# Altium schematic sheet Sheet1.SchDoc: RBCM_Mother
size A1; SheetNumber: 1; SheetTotal: 3
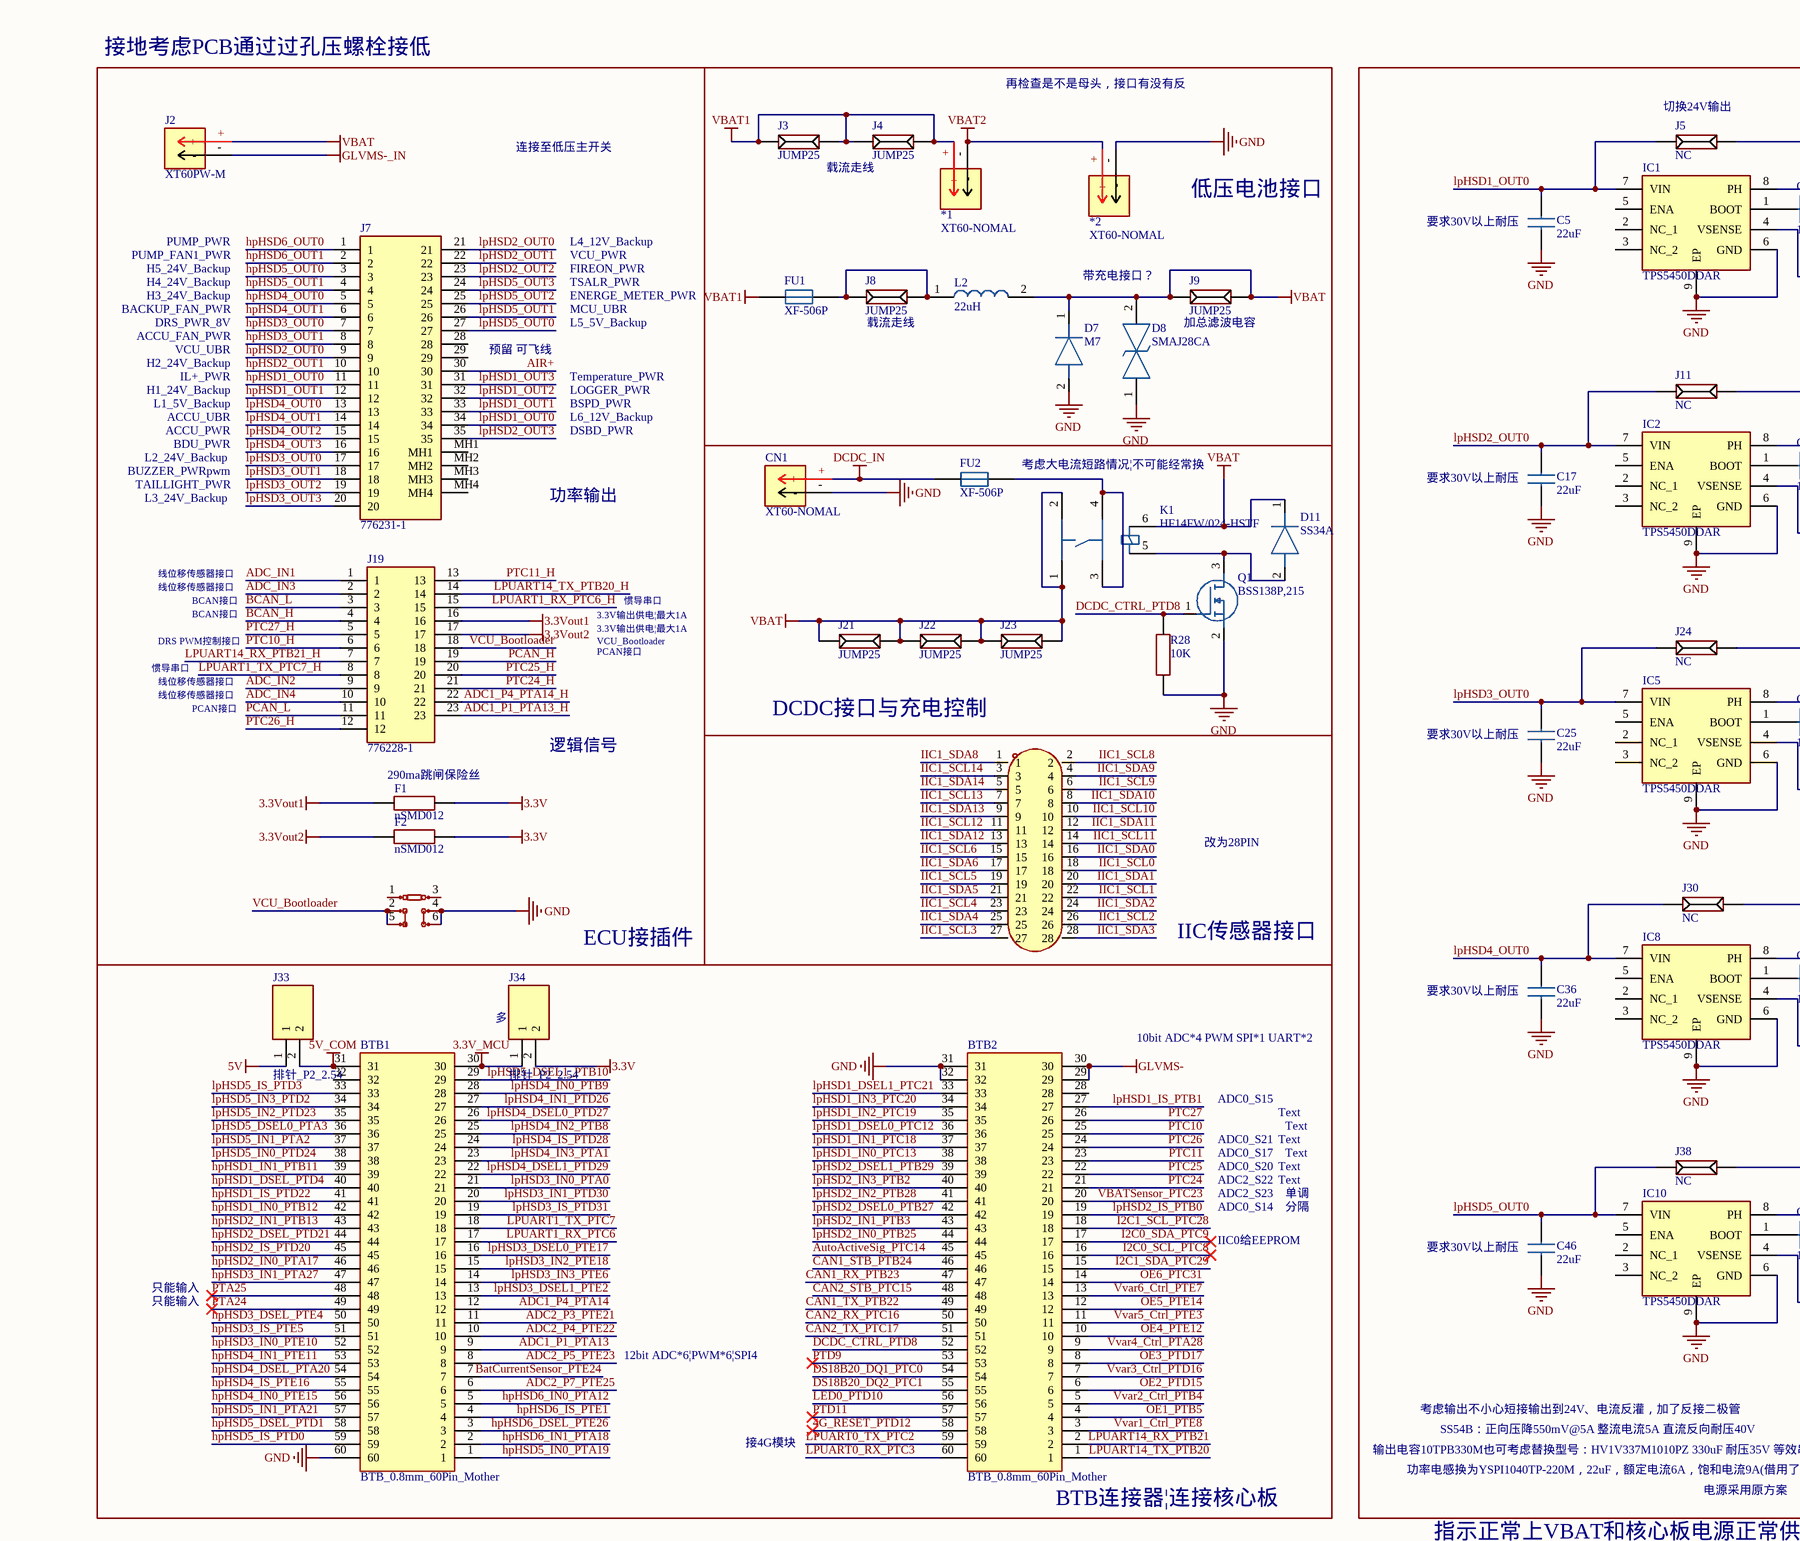
[diagram p0: Sheet1.SchDoc, top left]
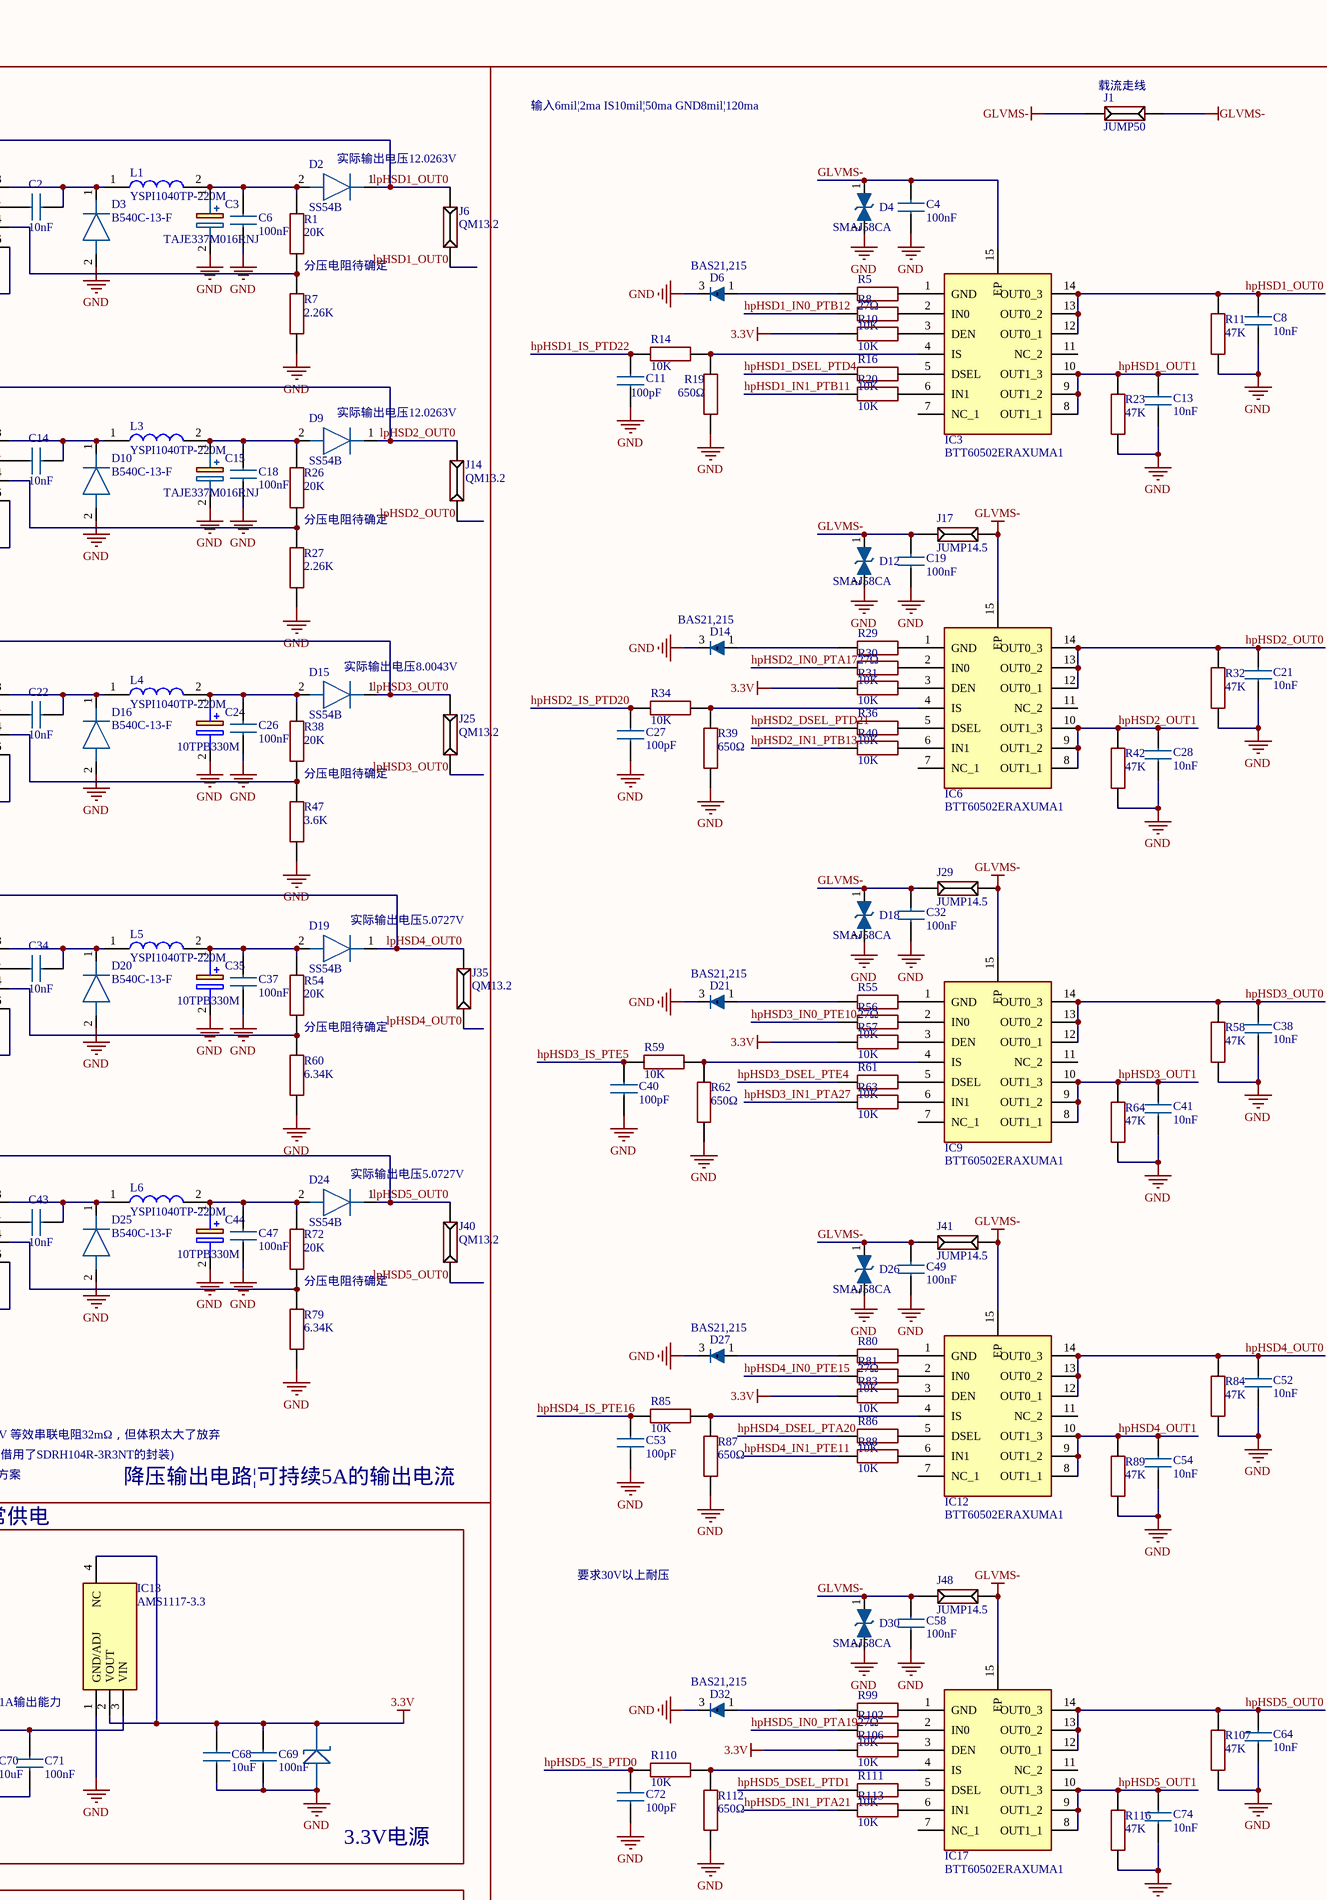
[diagram p1: Sheet1.SchDoc, top middle]
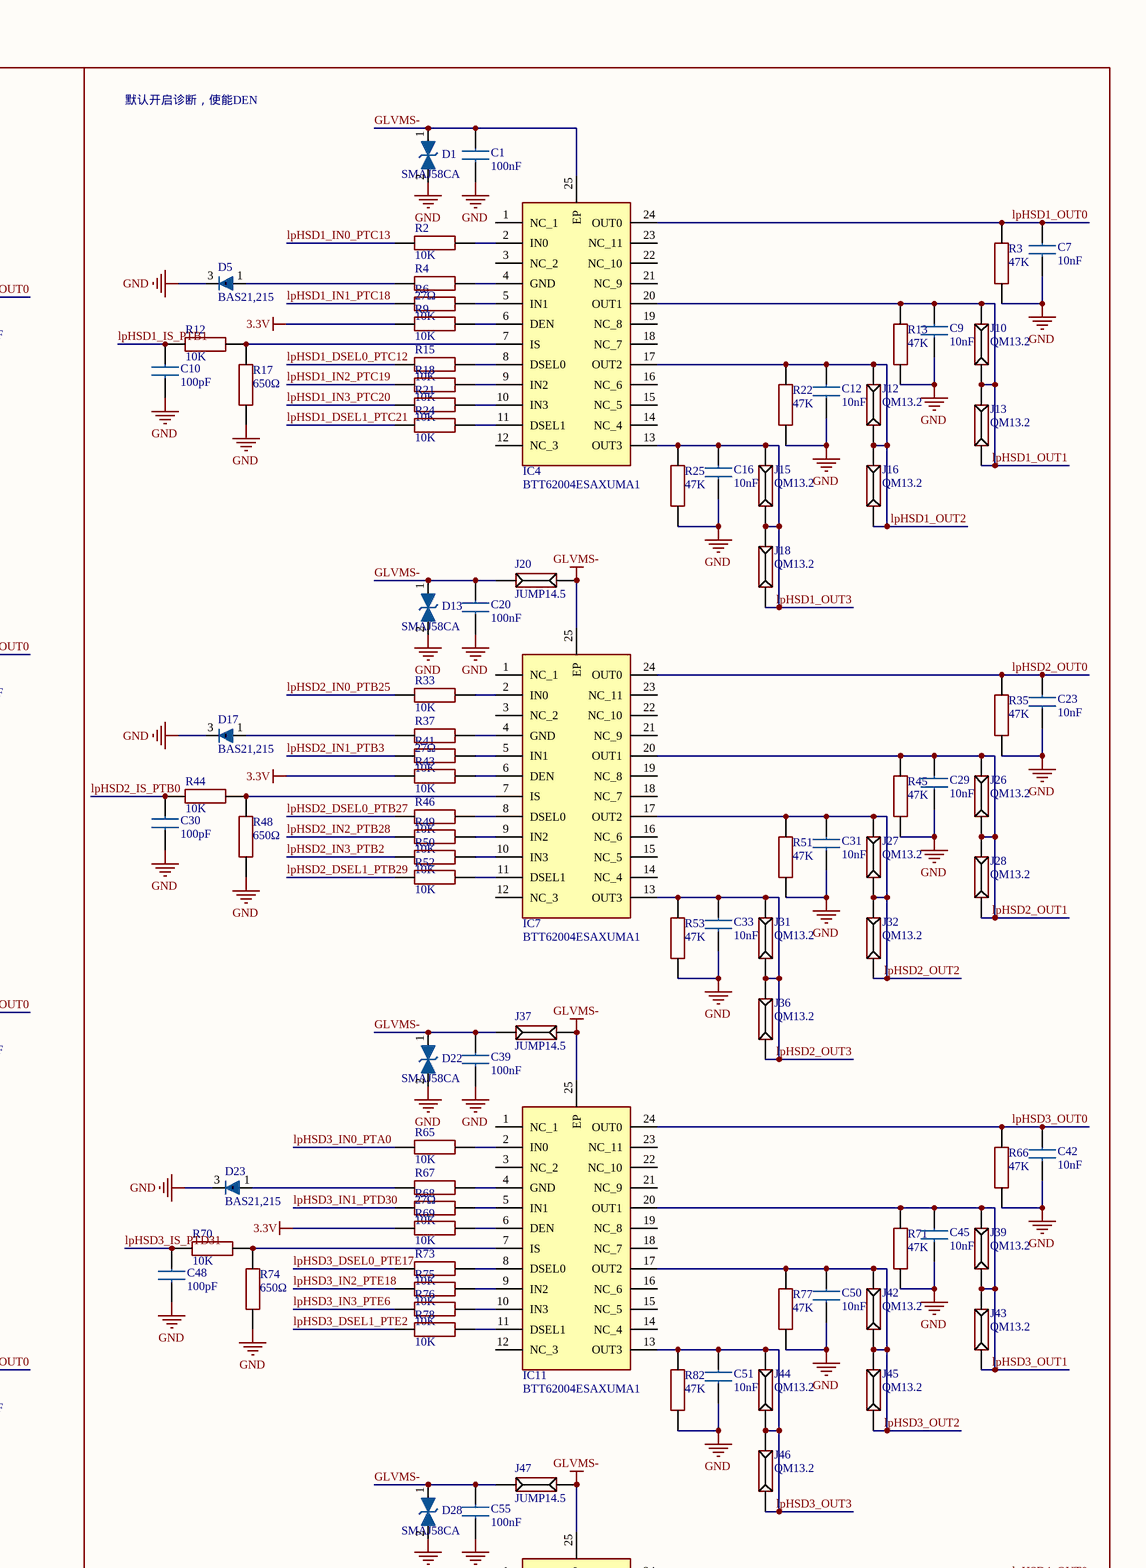
[diagram p2: Sheet1.SchDoc, top right]
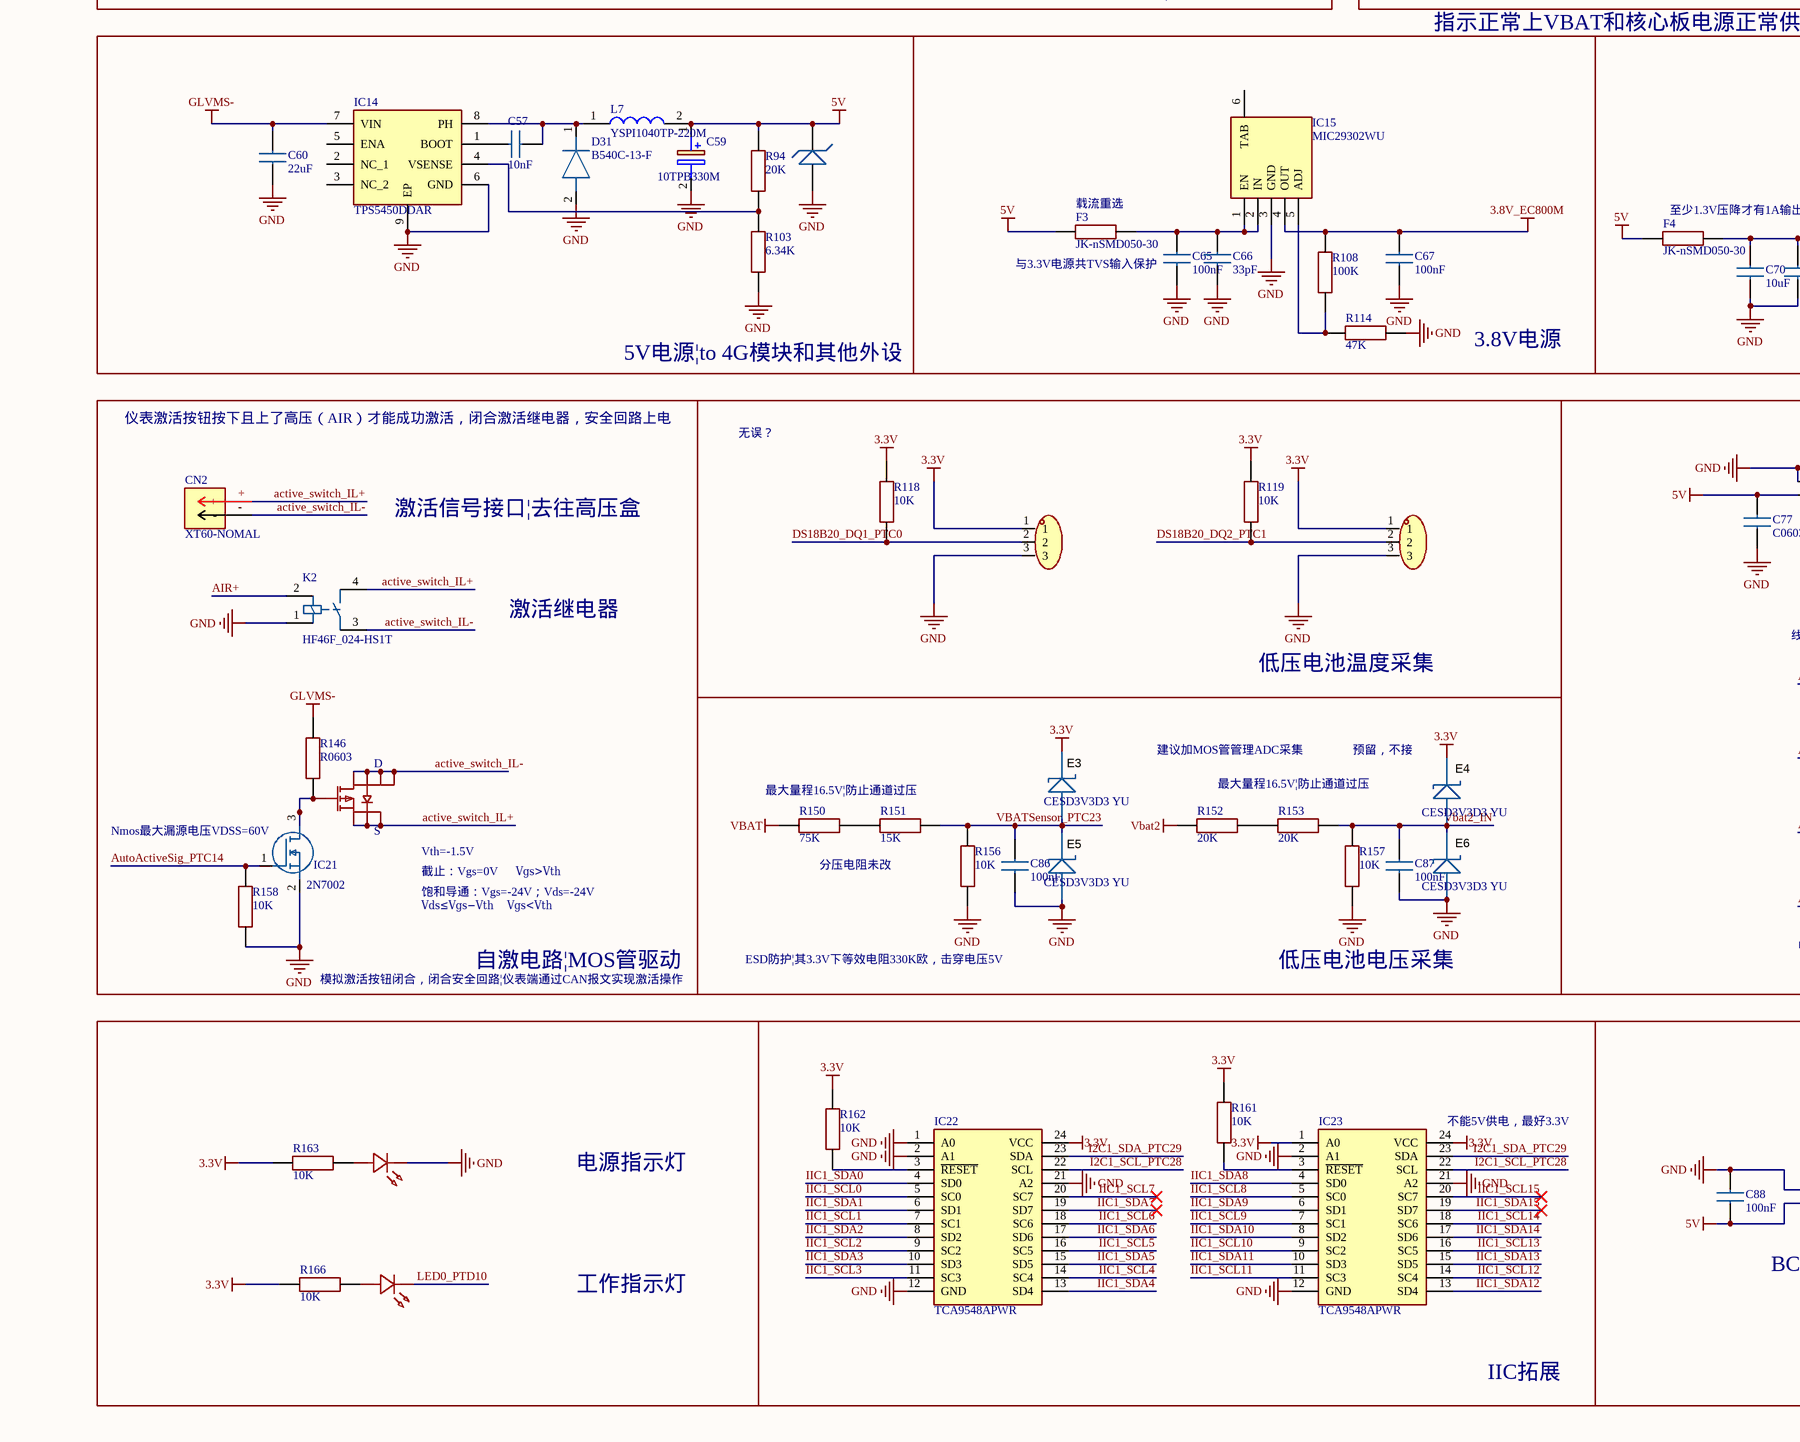
[diagram p3: Sheet1.SchDoc, bottom left]
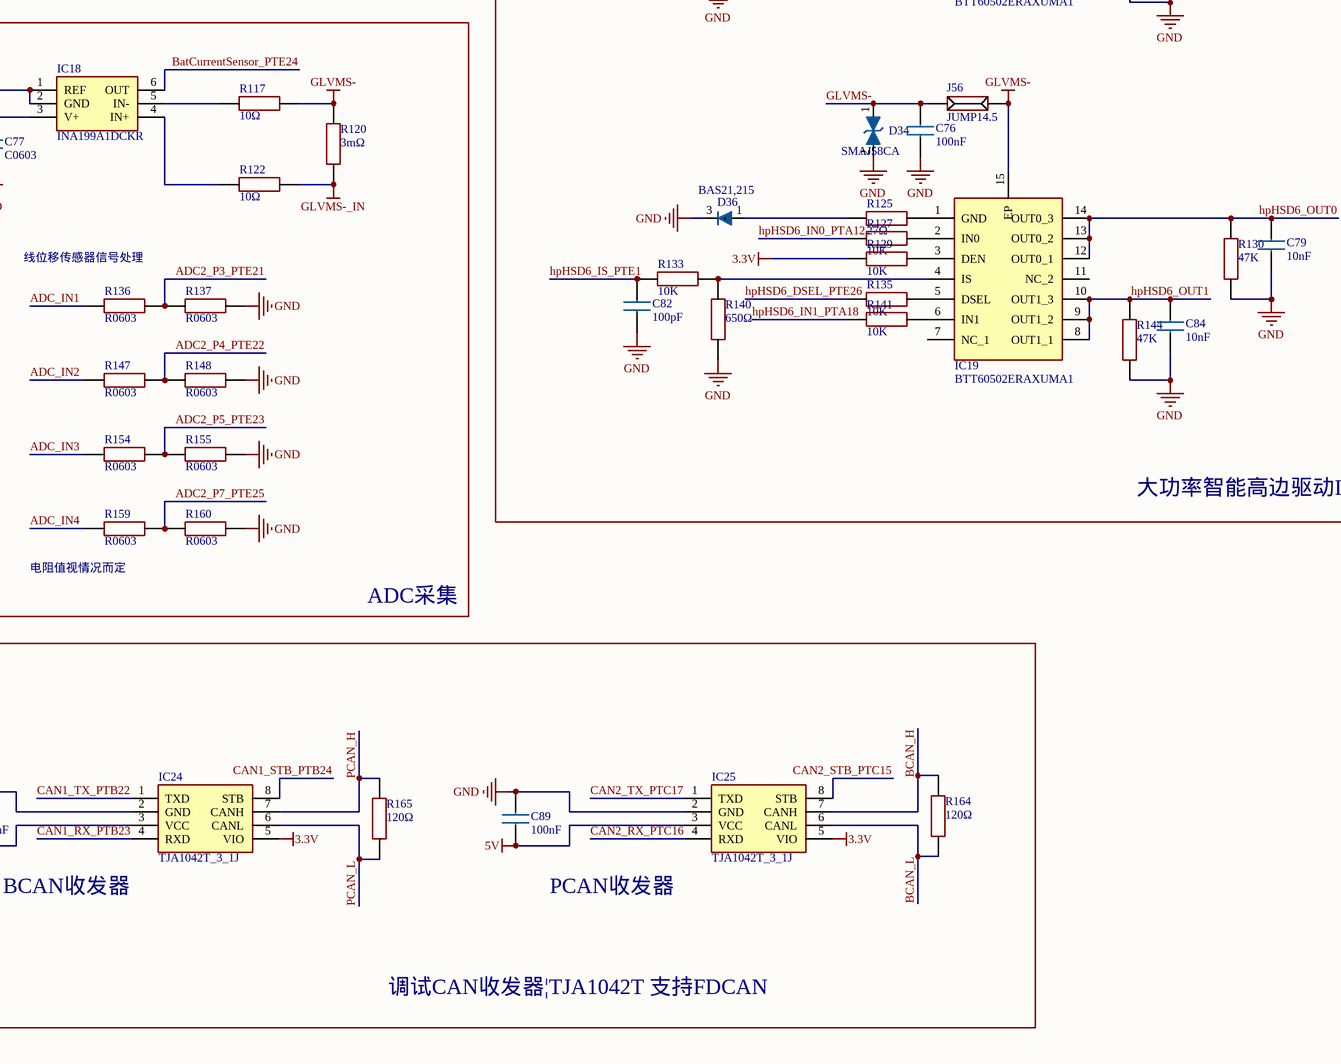
[diagram p4: Sheet1.SchDoc, bottom middle]
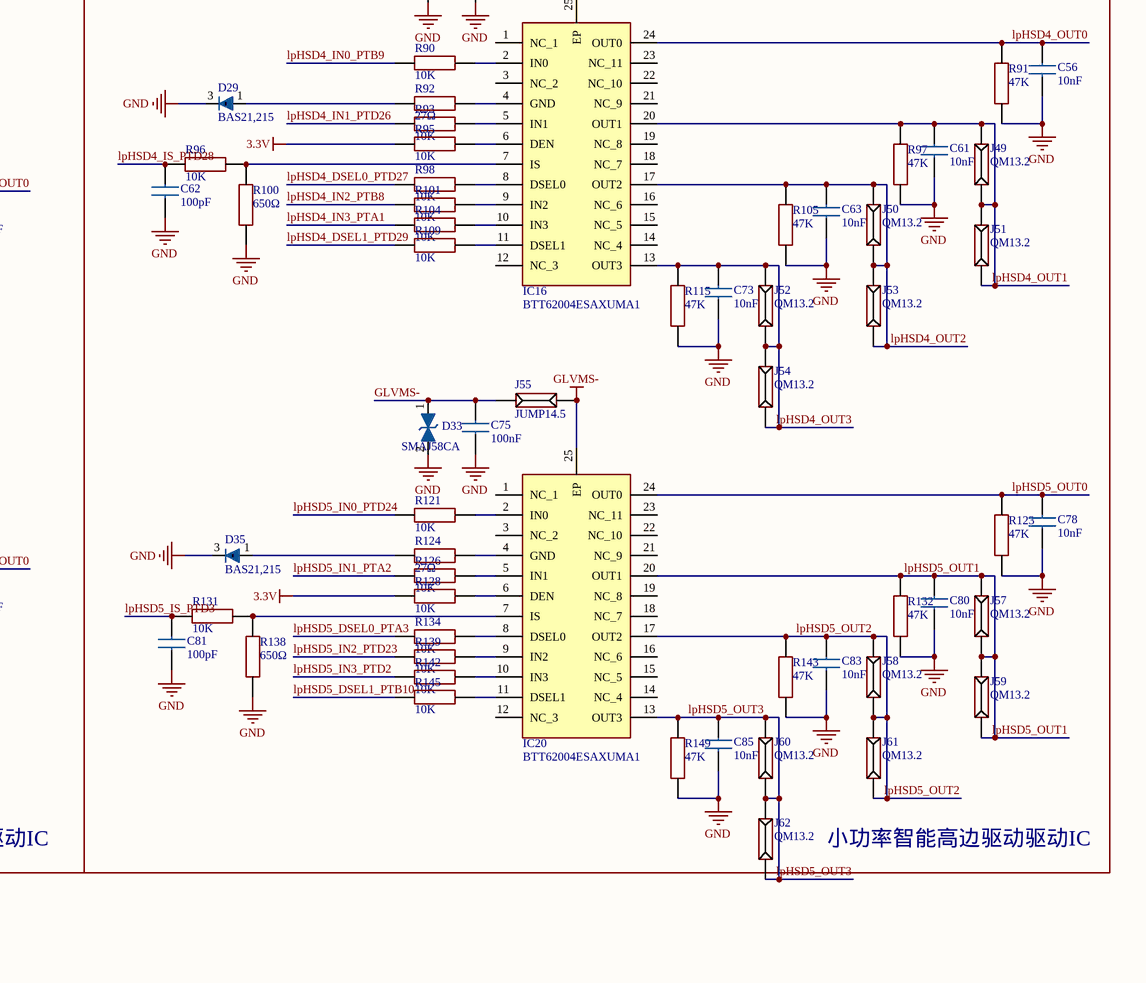
[diagram p5: Sheet1.SchDoc, bottom right]

## Parts
*1  XT60-NOMAL  [AMASS_XT60_NOMAL]
*2  XT60-NOMAL  [AMASS_XT60_NOMAL]
BTB1  BTB_0.8mm_60Pin_Mother  [BTB_0.8mm_60PIN_M]
BTB2  BTB_0.8mm_60Pin_Mother  [BTB_0.8mm_60PIN_M]
C1  100nF  [CAPC1608X90N]
C2  10nF  [CAPC1608X90N]
C3  TAJE337M016RNJ  [CAPPM7344X430N]
C4  100nF  [CAPC1608X90N]
C5  22uF  [CAPC2012X95N]
C6  100nF  [CAPC1608X90N]
C7  10nF  [CAPC1608X90N]
C8  10nF  [CAPC1608X90N]
C9  10nF  [CAPC1608X90N]
C10  100pF  [CAPC1608X90N]
C11  100pF  [CAPC1608X90N]
C12  10nF  [CAPC1608X90N]
C13  10nF  [CAPC1608X90N]
C14  10nF  [CAPC1608X90N]
C15  TAJE337M016RNJ  [CAPPM7344X430N]
C16  10nF  [CAPC1608X90N]
C17  22uF  [CAPC2012X95N]
C18  100nF  [CAPC1608X90N]
C19  100nF  [CAPC1608X90N]
C20  100nF  [CAPC1608X90N]
C21  10nF  [CAPC1608X90N]
C22  10nF  [CAPC1608X90N]
C23  10nF  [CAPC1608X90N]
C24  10TPB330M  [POSCAP_D12_D15_D15E_D2E_D2_D3L_D4]
C25  22uF  [CAPC2012X95N]
C26  100nF  [CAPC1608X90N]
C27  100pF  [CAPC1608X90N]
C28  10nF  [CAPC1608X90N]
C29  10nF  [CAPC1608X90N]
C30  100pF  [CAPC1608X90N]
C31  10nF  [CAPC1608X90N]
C32  100nF  [CAPC1608X90N]
C33  10nF  [CAPC1608X90N]
C34  10nF  [CAPC1608X90N]
C35  10TPB330M  [POSCAP_D12_D15_D15E_D2E_D2_D3L_D4]
C36  22uF  [CAPC2012X95N]
C37  100nF  [CAPC1608X90N]
C38  10nF  [CAPC1608X90N]
C39  100nF  [CAPC1608X90N]
C40  100pF  [CAPC1608X90N]
C41  10nF  [CAPC1608X90N]
C42  10nF  [CAPC1608X90N]
C43  10nF  [CAPC1608X90N]
C44  10TPB330M  [POSCAP_D12_D15_D15E_D2E_D2_D3L_D4]
C45  10nF  [CAPC1608X90N]
C46  22uF  [CAPC2012X95N]
C47  100nF  [CAPC1608X90N]
C48  100pF  [CAPC1608X90N]
C49  100nF  [CAPC1608X90N]
C50  10nF  [CAPC1608X90N]
C51  10nF  [CAPC1608X90N]
C52  10nF  [CAPC1608X90N]
C53  100pF  [CAPC1608X90N]
C54  10nF  [CAPC1608X90N]
C55  100nF  [CAPC1608X90N]
C56  10nF  [CAPC1608X90N]
C57  10nF  [CAPC1608X90N]
C58  100nF  [CAPC1608X90N]
C59  10TPB330M  [POSCAP_D12_D15_D15E_D2E_D2_D3L_D4]
C60  22uF  [CAPC2012X95N]
C61  10nF  [CAPC1608X90N]
C62  100pF  [CAPC1608X90N]
C63  10nF  [CAPC1608X90N]
C64  10nF  [CAPC1608X90N]
C65  100nF  [CAPC1608X90N]
C66  33pF  [CAPC1608X90N]
C67  100nF  [CAPC1608X90N]
C68  10uF  [CAPC1608X90N]
C69  100nF  [CAPC1608X90N]
C70  10uF  [CAPC1608X90N]
C71  100nF  [CAPC1608X90N]
C72  100pF  [CAPC1608X90N]
C73  10nF  [CAPC1608X90N]
C74  10nF  [CAPC1608X90N]
C75  100nF  [CAPC1608X90N]
C76  100nF  [CAPC1608X90N]
C77  C0603  [CAPC1608X90N]
C78  10nF  [CAPC1608X90N]
C79  10nF  [CAPC1608X90N]
C80  10nF  [CAPC1608X90N]
C81  100pF  [CAPC1608X90N]
C82  100pF  [CAPC1608X90N]
C83  10nF  [CAPC1608X90N]
C84  10nF  [CAPC1608X90N]
C85  10nF  [CAPC1608X90N]
C86  100nF  [CAPC1608X90N]
C87  100nF  [CAPC1608X90N]
C88  100nF  [CAPC1608X90N]
C89  100nF  [CAPC1608X90N]
CN1  XT60-NOMAL  [AMASS_XT60_NOMAL]
CN2  XT60-NOMAL  [AMASS_XT60_NOMAL]
CN3  ZX-XH2.54-3PZZ  [CONN-TH_3P-P2.54_2501S-3P]  (value not drawn)
CN4  ZX-XH2.54-3PZZ  [CONN-TH_3P-P2.54_2501S-3P]  (value not drawn)
D1  SMAJ58CA  [DIOM5026X229N]
D2  SS54B  [DIOM5336X244N]
D3  B540C-13-F  [DIOM7959X250N]
D4  SMAJ58CA  [DIOM5026X229N]
D5  BAS21,215  [BAS21215]
D6  BAS21,215  [BAS21215]
D7  M7  [DIOM5127X250N]
D8  SMAJ28CA  [DIONM5226X262N]
D9  SS54B  [DIOM5336X244N]
D10  B540C-13-F  [DIOM7959X250N]
D11  SS34A  [DIOM5026X262N]
D12  SMAJ58CA  [DIOM5026X229N]
D13  SMAJ58CA  [DIOM5026X229N]
D14  BAS21,215  [BAS21215]
D15  SS54B  [DIOM5336X244N]
D16  B540C-13-F  [DIOM7959X250N]
D17  BAS21,215  [BAS21215]
D18  SMAJ58CA  [DIOM5026X229N]
D19  SS54B  [DIOM5336X244N]
D20  B540C-13-F  [DIOM7959X250N]
D21  BAS21,215  [BAS21215]
D22  SMAJ58CA  [DIOM5026X229N]
D23  BAS21,215  [BAS21215]
D24  SS54B  [DIOM5336X244N]
D25  B540C-13-F  [DIOM7959X250N]
D26  SMAJ58CA  [DIOM5026X229N]
D27  BAS21,215  [BAS21215]
D28  SMAJ58CA  [DIOM5026X229N]
D29  BAS21,215  [BAS21215]
D30  SMAJ58CA  [DIOM5026X229N]
D31  B540C-13-F  [DIOM7959X250N]
D32  BAS21,215  [BAS21215]
D33  SMAJ58CA  [DIOM5026X229N]
D34  SMAJ58CA  [DIOM5026X229N]
D35  BAS21,215  [BAS21215]
D36  BAS21,215  [BAS21215]
E1  CESD5V0D3 ZA  [SOD-323_L1.8-W1.3-LS2.5-RD]  (value not drawn)
E2  CESD3V3D3 YU  [SOD-323_L1.8-W1.3-LS2.5-RD]  (value not drawn)
E3  CESD3V3D3 YU  [SOD-323_L1.8-W1.3-LS2.5-RD]
E4  CESD3V3D3 YU  [SOD-323_L1.8-W1.3-LS2.5-RD]
E5  CESD3V3D3 YU  [SOD-323_L1.8-W1.3-LS2.5-RD]
E6  CESD3V3D3 YU  [SOD-323_L1.8-W1.3-LS2.5-RD]
F1  nSMD012  [RESC3116X65N]
F2  nSMD012  [RESC3116X65N]
F3  JK-nSMD050-30  [RESC3116X65N]
F4  JK-nSMD050-30  [RESC3116X65N]
FU1  XF-506P  [XF-506P]
FU2  XF-506P  [XF-506P]
IC1  TPS5450DDAR  [SOIC127P600X170-9N]
IC2  TPS5450DDAR  [SOIC127P600X170-9N]
IC3  BTT60502ERAXUMA1  [SOIC127P600X115-15N]
IC4  BTT62004ESAXUMA1  [SOP65P600X115-25N]
IC5  TPS5450DDAR  [SOIC127P600X170-9N]
IC6  BTT60502ERAXUMA1  [SOIC127P600X115-15N]
IC7  BTT62004ESAXUMA1  [SOP65P600X115-25N]
IC8  TPS5450DDAR  [SOIC127P600X170-9N]
IC9  BTT60502ERAXUMA1  [SOIC127P600X115-15N]
IC10  TPS5450DDAR  [SOIC127P600X170-9N]
IC11  BTT62004ESAXUMA1  [SOP65P600X115-25N]
IC12  BTT60502ERAXUMA1  [SOIC127P600X115-15N]
IC13  AMS1117-3.3  [SOT229P700X180-4N]
IC14  TPS5450DDAR  [SOIC127P600X170-9N]
IC15  MIC29302WU  [MIC29302WU]
IC16  BTT62004ESAXUMA1  [SOP65P600X115-25N]
IC17  BTT60502ERAXUMA1  [SOIC127P600X115-15N]
IC18  INA199A1DCKR  [SOT65P210X110-6N]
IC19  BTT60502ERAXUMA1  [SOIC127P600X115-15N]
IC20  BTT62004ESAXUMA1  [SOP65P600X115-25N]
IC21  2N7002  [SOT95P230X110-3N]
IC22  TCA9548APWR  [SOP65P640X120-24N]
IC23  TCA9548APWR  [SOP65P640X120-24N]
IC24  TJA1042T_3_1J  [SOIC127P600X175-8N]
IC25  TJA1042T_3_1J  [SOIC127P600X175-8N]
J1  JUMP50  [JUMP50]
J2  XT60PW-M  [AMASS_XT60PW_M]
J3  JUMP25  [JUMP25_Au]
J4  JUMP25  [JUMP25_Au]
J5  NC  [QM13.2]
J6  QM13.2  [QM13.2]
J7  776231-1  [7762311]
J8  JUMP25  [JUMP25_Au]
J9  JUMP25  [JUMP25_Au]
J10  QM13.2  [QM13.2]
J11  NC  [QM13.2]
J12  QM13.2  [QM13.2]
J13  QM13.2  [QM13.2]
J14  QM13.2  [QM13.2]
J15  QM13.2  [QM13.2]
J16  QM13.2  [QM13.2]
J17  JUMP14.5  [JUMP14.5]
J18  QM13.2  [QM13.2]
J19  776228-1  [7762281]
J20  JUMP14.5  [JUMP14.5]
J21  JUMP25  [JUMP25_Au]
J22  JUMP25  [JUMP25_Au]
J23  JUMP25  [JUMP25_Au]
J24  NC  [QM13.2]
J25  QM13.2  [QM13.2]
J26  QM13.2  [QM13.2]
J27  QM13.2  [QM13.2]
J28  QM13.2  [QM13.2]
J29  JUMP14.5  [JUMP14.5]
J30  NC  [QM13.2]
J31  QM13.2  [QM13.2]
J32  QM13.2  [QM13.2]
J33  排针_P2_2.54  [HDRV2W66P0X254_1X2_508X250X880P]
J34  排针_P2_2.54  [HDRV2W66P0X254_1X2_508X250X880P]
J35  QM13.2  [QM13.2]
J36  QM13.2  [QM13.2]
J37  JUMP14.5  [JUMP14.5]
J38  NC  [QM13.2]
J39  QM13.2  [QM13.2]
J40  QM13.2  [QM13.2]
J41  JUMP14.5  [JUMP14.5]
J42  QM13.2  [QM13.2]
J43  QM13.2  [QM13.2]
J44  QM13.2  [QM13.2]
J45  QM13.2  [QM13.2]
J46  QM13.2  [QM13.2]
J47  JUMP14.5  [JUMP14.5]
J48  JUMP14.5  [JUMP14.5]
J49  QM13.2  [QM13.2]
J50  QM13.2  [QM13.2]
J51  QM13.2  [QM13.2]
J52  QM13.2  [QM13.2]
J53  QM13.2  [QM13.2]
J54  QM13.2  [QM13.2]
J55  JUMP14.5  [JUMP14.5]
J56  JUMP14.5  [JUMP14.5]
J57  QM13.2  [QM13.2]
J58  QM13.2  [QM13.2]
J59  QM13.2  [QM13.2]
J60  QM13.2  [QM13.2]
J61  QM13.2  [QM13.2]
J62  QM13.2  [QM13.2]
K1  HF14FW/024-HSTF  [HF14FW005HPTF]
K2  HF46F_024-HS1T  [HF46F024HS1T]
L1  YSPI1040TP-220M  [SDRH104R3R3NT]
L2  22uH  [磁环电感_卧式]
L3  YSPI1040TP-220M  [SDRH104R3R3NT]
L4  YSPI1040TP-220M  [SDRH104R3R3NT]
L5  YSPI1040TP-220M  [SDRH104R3R3NT]
L6  YSPI1040TP-220M  [SDRH104R3R3NT]
L7  YSPI1040TP-220M  [SDRH104R3R3NT]
LED1  XL-1606UGC  [LED-SMD_L1.7-W1.1-R-RD_GREEN]  (value not drawn)
LED2  XL-1606UGC  [LED-SMD_L1.7-W1.1-R-RD_GREEN]  (value not drawn)
Q1  BSS138P,215  [SOT95P230X110-3N]
Q2  4409  [SOP-8_L4.9-W3.8-P1.27-LS6.0-BL]  (value not drawn)
R1  20K  [RESC1608X55N]
R2  10K  [RESC1608X55N]
R3  47K  [RESC1608X55N]
R4  27Ω  [RESC1608X55N]
R5  27Ω  [RESC1608X55N]
R6  10K  [RESC1608X55N]
R7  2.26K  [RESC1608X55N]
R8  10K  [RESC1608X55N]
R9  10K  [RESC1608X55N]
R10  10K  [RESC1608X55N]
R11  47K  [RESC1608X55N]
R12  10K  [RESC1608X55N]
R13  47K  [RESC1608X55N]
R14  10K  [RESC1608X55N]
R15  10K  [RESC1608X55N]
R16  10K  [RESC1608X55N]
R17  650Ω  [RESC1608X55N]
R18  10K  [RESC1608X55N]
R19  650Ω  [RESC1608X55N]
R20  10K  [RESC1608X55N]
R21  10K  [RESC1608X55N]
R22  47K  [RESC1608X55N]
R23  47K  [RESC1608X55N]
R24  10K  [RESC1608X55N]
R25  47K  [RESC1608X55N]
R26  20K  [RESC1608X55N]
R27  2.26K  [RESC1608X55N]
R28  10K  [RESC1608X55N]
R29  27Ω  [RESC1608X55N]
R30  10K  [RESC1608X55N]
R31  10K  [RESC1608X55N]
R32  47K  [RESC1608X55N]
R33  10K  [RESC1608X55N]
R34  10K  [RESC1608X55N]
R35  47K  [RESC1608X55N]
R36  10K  [RESC1608X55N]
R37  27Ω  [RESC1608X55N]
R38  20K  [RESC1608X55N]
R39  650Ω  [RESC1608X55N]
R40  10K  [RESC1608X55N]
R41  10K  [RESC1608X55N]
R42  47K  [RESC1608X55N]
R43  10K  [RESC1608X55N]
R44  10K  [RESC1608X55N]
R45  47K  [RESC1608X55N]
R46  10K  [RESC1608X55N]
R47  3.6K  [RESC1608X55N]
R48  650Ω  [RESC1608X55N]
R49  10K  [RESC1608X55N]
R50  10K  [RESC1608X55N]
R51  47K  [RESC1608X55N]
R52  10K  [RESC1608X55N]
R53  47K  [RESC1608X55N]
R54  20K  [RESC1608X55N]
R55  27Ω  [RESC1608X55N]
R56  10K  [RESC1608X55N]
R57  10K  [RESC1608X55N]
R58  47K  [RESC1608X55N]
R59  10K  [RESC1608X55N]
R60  6.34K  [RESC1608X55N]
R61  10K  [RESC1608X55N]
R62  650Ω  [RESC1608X55N]
R63  10K  [RESC1608X55N]
R64  47K  [RESC1608X55N]
R65  10K  [RESC1608X55N]
R66  47K  [RESC1608X55N]
R67  27Ω  [RESC1608X55N]
R68  10K  [RESC1608X55N]
R69  10K  [RESC1608X55N]
R70  10K  [RESC1608X55N]
R71  47K  [RESC1608X55N]
R72  20K  [RESC1608X55N]
R73  10K  [RESC1608X55N]
R74  650Ω  [RESC1608X55N]
R75  10K  [RESC1608X55N]
R76  10K  [RESC1608X55N]
R77  47K  [RESC1608X55N]
R78  10K  [RESC1608X55N]
R79  6.34K  [RESC1608X55N]
R80  27Ω  [RESC1608X55N]
R81  10K  [RESC1608X55N]
R82  47K  [RESC1608X55N]
R83  10K  [RESC1608X55N]
R84  47K  [RESC1608X55N]
R85  10K  [RESC1608X55N]
R86  10K  [RESC1608X55N]
R87  650Ω  [RESC1608X55N]
R88  10K  [RESC1608X55N]
R89  47K  [RESC1608X55N]
R90  10K  [RESC1608X55N]
R91  47K  [RESC1608X55N]
R92  27Ω  [RESC1608X55N]
R93  10K  [RESC1608X55N]
R94  20K  [RESC1608X55N]
R95  10K  [RESC1608X55N]
R96  10K  [RESC1608X55N]
R97  47K  [RESC1608X55N]
R98  10K  [RESC1608X55N]
R99  27Ω  [RESC1608X55N]
R100  650Ω  [RESC1608X55N]
R101  10K  [RESC1608X55N]
R102  10K  [RESC1608X55N]
R103  6.34K  [RESC1608X55N]
R104  10K  [RESC1608X55N]
R105  47K  [RESC1608X55N]
R106  10K  [RESC1608X55N]
R107  47K  [RESC1608X55N]
R108  100K  [RESC1608X55N]
R109  10K  [RESC1608X55N]
R110  10K  [RESC1608X55N]
R111  10K  [RESC1608X55N]
R112  650Ω  [RESC1608X55N]
R113  10K  [RESC1608X55N]
R114  47K  [RESC1608X55N]
R115  47K  [RESC1608X55N]
R116  47K  [RESC1608X55N]
R117  10Ω  [RESC1608X55N]
R118  10K  [RESC1608X55N]
R119  10K  [RESC1608X55N]
R120  3mΩ  [RESC6432X06N__2512RES]
R121  10K  [RESC1608X55N]
R122  10Ω  [RESC1608X55N]
R123  47K  [RESC1608X55N]
R124  27Ω  [RESC1608X55N]
R125  27Ω  [RESC1608X55N]
R126  10K  [RESC1608X55N]
R127  10K  [RESC1608X55N]
R128  10K  [RESC1608X55N]
R129  10K  [RESC1608X55N]
R130  47K  [RESC1608X55N]
R131  10K  [RESC1608X55N]
R132  47K  [RESC1608X55N]
R133  10K  [RESC1608X55N]
R134  10K  [RESC1608X55N]
R135  10K  [RESC1608X55N]
R136  R0603  [RESC1608X55N]
R137  R0603  [RESC1608X55N]
R138  650Ω  [RESC1608X55N]
R139  10K  [RESC1608X55N]
R140  650Ω  [RESC1608X55N]
R141  10K  [RESC1608X55N]
R142  10K  [RESC1608X55N]
R143  47K  [RESC1608X55N]
R144  47K  [RESC1608X55N]
R145  10K  [RESC1608X55N]
R146  R0603  [RESC1608X55N]
R147  R0603  [RESC1608X55N]
R148  R0603  [RESC1608X55N]
R149  47K  [RESC1608X55N]
R150  75K  [RESC1608X55N]
R151  15K  [RESC1608X55N]
R152  20K  [RESC1608X55N]
R153  20K  [RESC1608X55N]
R154  R0603  [RESC1608X55N]
R155  R0603  [RESC1608X55N]
R156  10K  [RESC1608X55N]
R157  10K  [RESC1608X55N]
R158  10K  [RESC1608X55N]
R159  R0603  [RESC1608X55N]
R160  R0603  [RESC1608X55N]
R161  10K  [RESC1608X55N]
R162  10K  [RESC1608X55N]
R163  10K  [RESC1608X55N]
R164  120Ω  [RESC1608X55N]
R165  120Ω  [RESC1608X55N]
R166  10K  [RESC1608X55N]
SW1  XKB5858-Z-E  [SW-TH_XKB5858-Z-E]  (value not drawn)
U1  PHB2.0-02-28PZZ  [CONN-TH_28P-P2.00_XUNPU_PHB2.0-02-28PZZ]  (value not drawn)

## Blocks framed on the sheet
低压电池接口: *1 *2 D7 D8 FU1 J3 J4 J8 J9 L2
降压输出电路¦可持续5A的输出电流: C2 C3 C5 C6 C14 C15 C17 C18 C22 C24-C26 C34-C37 C43 C44 C46 C47 D2 D3 D9 D10 D15 D16 D19 D20 D24 D25 IC1 IC2 IC5 IC8 IC10 J5 J6 J11 J14 J24 J25 J30 J35 J38 J40 L1 L3-L6 R1 R7 R26 R27 R38 R47 R54 R60 R72 R79
大功率智能高边驱动IC: C4 C8 C11 C13 C19 C21 C27 C28 C32 C38 C40 C41 C49 C52-C54 C58 C64 C72 C74 C76 C79 C82 C84 D4 D6 D12 D14 D18 D21 D26 D27 D30 D32 D34 D36 IC3 IC6 IC9 IC12 IC17 IC19 J1 J17 J29 J41 J48 J56 R5 R8 R10 R11 R14 R16 R19 R20 R23 R29-R32 R34 R36 R39 R40 R42 R55-R59 R61-R64 R80 R81 R83-R89 R99 R102 R106 R107 R110-R113 R116 R125 R127 R129 R130 R133 R135 R140 R141 R144
小功率智能高边驱动驱动IC: C1 C7 C9 C10 C12 C16 C20 C23 C29-C31 C33 C39 C42 C45 C48 C50 C51 C55 C56 C61-C63 C73 C75 C78 C80 C81 C83 C85 D1 D5 D13 D17 D22 D23 D28 D29 D33 D35 IC4 IC7 IC11 IC16 IC20 J10 J12 J13 J15 J16 J18 J20 J26-J28 J31 J32 J36 J37 J39 J42-J47 J49-J55 J57-J62 R2-R4 R6 R9 R12 R13 R15 R17 R18 R21 R22 R24 R25 R33 R35 R37 R41 R43-R46 R48-R53 R65-R71 R73-R78 R82 R90-R93 R95-R98 R100 R101 R104 R105 R109 R115 R121 R123 R124 R126 R128 R131 R132 R134 R138 R139 R142 R143 R145 R149
DCDC接口与充电控制: CN1 D11 FU2 J21-J23 K1 Q1 R28
5V电源¦to 4G模块和其他外设: C57 C59 C60 D31 E1 IC14 L7 R94 R103
3.3V电源: C68-C71 E2 F4 IC13
低压电池温度采集: CN3 CN4 R118 R119
ADC采集: C77 IC18 R117 R120 R122 R136 R137 R147 R148 R154 R155 R159 R160
低压电池电压采集: C86 C87 E3-E6 R150-R153 R156 R157
IIC拓展: IC22 IC23 R161 R162

## Nets
3.3V: C68.2 C69.2 CN3.1 CN4.1 E2.1 E3.1 E4.1 F1.1 F2.1 IC13.2(VOUT) IC13.4(NC) IC22.24(VCC) IC23.1(A0) IC23.24(VCC) IC24.5(VIO) IC25.5(VIO) J34.2 R9.1 R10.1 R31.1 R43.1 R57.1 R69.1 R83.1 R95.1 R106.1 R118.2 R119.2 R128.1 R129.1 R161.1 R162.1 R163.2 R166.2
3.3V_MCU: BTB1.30 J34.1
3.3Vout1: F1.2 J19.16
3.3Vout2: F2.2 J19.17
3.8V_EC800M: C67.2 IC15.4(OUT) R108.1
5V: C59.1(+) C77.2 C88.1 C89.1 E1.1 F3.2 F4.2 IC18.3(V+) IC24.3(VCC) IC25.3(VCC) J33.1 L7.2 R94.1
5V_COM: BTB1.31 J33.2
DCDC_IN: CN1.+ FU2.1
GLVMS-: BTB2.29 BTB2.30 C1.1 C4.1 C19.1 C20.1 C32.1 C39.1 C49.1 C55.1 C58.1 C60.2 C75.1 C76.1 D1.1 D4.1 D12.1 D13.1 D18.1 D22.1 D26.1 D28.1 D30.1 D33.1 D34.1 IC3.15(EP) IC4.25(EP) IC6.15(EP) IC7.25(EP) IC9.15(EP) IC11.25(EP) IC12.15(EP) IC14.7(VIN) IC16.25(EP) IC17.15(EP) IC19.15(EP) IC20.25(EP) J1.1 J1.2 J17.1 J17.2 J20.1 J20.2 J29.1 J29.2 J37.1 J37.2 J41.1 J41.2 J47.1 J47.2 J48.1 J48.2 J55.1 J55.2 J56.1 J56.2 R117.2 R120.2 R146.2
GLVMS-_IN: J2.- R120.1 R122.2
GND: *2.- BTB1.60 BTB2.31 BTB2.32 C1.2 C3.2(-) C4.2 C5.1 C6.1 C7.1 C8.1 C9.1 C10.1 C11.1 C12.1 C13.1 C15.2(-) C16.1 C17.1 C18.1 C19.2 C20.2 C21.1 C23.1 C24.2(-) C25.1 C26.1 C27.1 C28.1 C29.1 C30.1 C31.1 C32.2 C33.1 C35.2(-) C36.1 C37.1 C38.1 C39.2 C40.1 C41.1 C42.1 C44.2(-) C45.1 C46.1 C47.1 C48.1 C49.2 C50.1 C51.1 C52.1 C53.1 C54.1 C55.2 C56.1 C58.2 C59.2(-) C60.1 C61.1 C62.1 C63.1 C64.1 C65.1 C66.1 C67.1 C68.1 C69.1 C70.1 C71.1 C72.1 C73.1 C74.1 C75.2 C76.2 C77.1 C78.1 C79.1 C80.1 C81.1 C82.1 C83.1 C84.1 C85.1 C86.1 C87.1 C88.2 C89.2 CN1.- CN3.3 CN4.3 D1.2 D3.2(A) D4.2 D5.3(K) D6.3(K) D7.2(A) D8.1 D10.2(A) D12.2 D13.2 D14.3(K) D16.2(A) D17.3(K) D18.2 D20.2(A) D21.3(K) D22.2 D23.3(K) D25.2(A) D26.2 D27.3(K) D28.2 D29.3(K) D30.2 D31.2(A) D32.3(K) D33.2 D34.2 D35.3(K) D36.3(K) E1.2 E2.2 E5.2 E6.2 IC1.6(GND) IC1.9(EP) IC2.6(GND) IC2.9(EP) IC5.6(GND) IC5.9(EP) IC8.6(GND) IC8.9(EP) IC10.6(GND) IC10.9(EP) IC13.1(GND/ADJ) IC14.6(GND) IC14.9(EP) IC15.3(GND) IC18.1(REF) IC18.2(GND) IC21.2(S) IC22.1(A0) IC22.2(A1) IC22.12(GND) IC22.21(A2) IC23.2(A1) IC23.12(GND) IC23.21(A2) IC24.2(GND) IC25.2(GND) K2.1(COIL_1) LED1.2(K) Q1.2(S) R3.1 R7.1 R11.1 R13.1 R17.2 R19.2 R22.1 R23.1 R25.1 R27.1 R28.1 R32.1 R35.1 R39.2 R42.1 R45.1 R47.1 R48.2 R51.1 R53.1 R58.1 R60.1 R62.2 R64.1 R66.1 R71.1 R74.2 R77.1 R79.1 R82.1 R84.1 R87.2 R89.1 R91.1 R97.1 R100.2 R103.1 R105.1 R107.1 R112.2 R114.1 R115.1 R116.1 R123.1 R130.1 R132.1 R137.2 R138.2 R140.2 R143.1 R144.1 R148.2 R149.1 R155.2 R156.1 R157.1 R158.2 R160.2 SW1.4 SW1.6
VBAT: D7.1(K) D8.2 D11.1(K) J2.+ J9.1 J9.2 J21.1 J21.2 J22.1 J22.2 J23.1 J23.2 K1.1(NO_1) K1.2(NO_2) K1.6(COIL_2) L2.2 R150.2
VBAT1: *1.+ FU1.1 J3.1 J3.2 J4.1 J4.2
VBAT2: *1.- *2.+ R152.2
4G_RESET_PTD12: BTB2.58
active_switch_IL+: CN2.+ K2.4(COM) Q2.1(S) Q2.2(S) Q2.3(S)
active_switch_IL-: CN2.- K2.3(NO) Q2.5(D) Q2.6(D) Q2.7(D) Q2.8(D)
ADC1_P1_PTA13: BTB1.9
ADC1_P1_PTA13_H: J19.23
ADC1_P4_PTA14: BTB1.12
ADC1_P4_PTA14_H: J19.22
ADC2_P3_PTE21: BTB1.11 R136.2 R137.1
ADC2_P4_PTE22: BTB1.10 R147.2 R148.1
ADC2_P5_PTE23: BTB1.8 R154.2 R155.1
ADC2_P7_PTE25: BTB1.6 R159.2 R160.1
ADC_IN1: J19.1 R136.1
ADC_IN2: J19.9 R147.1
ADC_IN3: J19.2 R154.1
ADC_IN4: J19.10 R159.1
AIR+: J7.30 K2.2(COIL_2)
AutoActiveSig_PTC14: BTB2.45 IC21.1(G) R158.1
BatCurrentSensor_PTE24: BTB1.7 IC18.6(OUT)
BCAN_H: IC25.7(CANH) J19.4 R164.2
BCAN_L: IC25.6(CANL) J19.3 R164.1
CAN1_RX_PTB23: BTB2.47 IC24.4(RXD)
CAN1_STB_PTB24: BTB2.46 IC24.8(STB)
CAN1_TX_PTB22: BTB2.49 IC24.1(TXD)
CAN2_RX_PTC16: BTB2.50 IC25.4(RXD)
CAN2_STB_PTC15: BTB2.48 IC25.8(STB)
CAN2_TX_PTC17: BTB2.51 IC25.1(TXD)
DCDC_CTRL_PTD8: BTB2.52 Q1.1(G) R28.2
DS18B20_DQ1_PTC0: BTB2.54 CN3.2 R118.1
DS18B20_DQ2_PTC1: BTB2.55 CN4.2 R119.1
hpHSD1_DSEL_PTD4: BTB1.40 R16.1
hpHSD1_IN0_PTB12: BTB1.42 R8.1
hpHSD1_IN1_PTB11: BTB1.39 R20.1
hpHSD1_IS_PTD22: BTB1.41 C11.2 R14.1
hpHSD1_OUT0: C8.2 IC3.12(OUT0_1) IC3.13(OUT0_2) IC3.14(OUT0_3) J7.11 R11.2
hpHSD1_OUT1: C13.2 IC3.8(OUT1_1) IC3.9(OUT1_2) IC3.10(OUT1_3) J7.12 R23.2
hpHSD2_DSEL_PTD21: BTB1.44 R36.1
hpHSD2_IN0_PTA17: BTB1.46 R30.1
hpHSD2_IN1_PTB13: BTB1.43 R40.1
hpHSD2_IS_PTD20: BTB1.45 C27.2 R34.1
hpHSD2_OUT0: C21.2 IC6.12(OUT0_1) IC6.13(OUT0_2) IC6.14(OUT0_3) J7.9 R32.2
hpHSD2_OUT1: C28.2 IC6.8(OUT1_1) IC6.9(OUT1_2) IC6.10(OUT1_3) J7.10 R42.2
hpHSD3_DSEL_PTE4: BTB1.50 R61.1
hpHSD3_IN0_PTE10: BTB1.52 R56.1
hpHSD3_IN1_PTA27: BTB1.47 R63.1
hpHSD3_IS_PTE5: BTB1.51 C40.2 R59.1
hpHSD3_OUT0: C38.2 IC9.12(OUT0_1) IC9.13(OUT0_2) IC9.14(OUT0_3) J7.7 R58.2
hpHSD3_OUT1: C41.2 IC9.8(OUT1_1) IC9.9(OUT1_2) IC9.10(OUT1_3) J7.8 R64.2
hpHSD4_DSEL_PTA20: BTB1.54 R86.1
hpHSD4_IN0_PTE15: BTB1.56 R81.1
hpHSD4_IN1_PTE11: BTB1.53 R88.1
hpHSD4_IS_PTE16: BTB1.55 C53.2 R85.1
hpHSD4_OUT0: C52.2 IC12.12(OUT0_1) IC12.13(OUT0_2) IC12.14(OUT0_3) J7.5 R84.2
hpHSD4_OUT1: C54.2 IC12.8(OUT1_1) IC12.9(OUT1_2) IC12.10(OUT1_3) J7.6 R89.2
hpHSD5_DSEL_PTD1: BTB1.58 R111.1
hpHSD5_IN0_PTA19: BTB1.1 R102.1
hpHSD5_IN1_PTA21: BTB1.57 R113.1
hpHSD5_IS_PTD0: BTB1.59 C72.2 R110.1
hpHSD5_OUT0: C64.2 IC17.12(OUT0_1) IC17.13(OUT0_2) IC17.14(OUT0_3) J7.3 R107.2
hpHSD5_OUT1: C74.2 IC17.8(OUT1_1) IC17.9(OUT1_2) IC17.10(OUT1_3) J7.4 R116.2
hpHSD6_DSEL_PTE26: BTB1.3 R135.1
hpHSD6_IN0_PTA12: BTB1.5 R127.1
hpHSD6_IN1_PTA18: BTB1.2 R141.1
hpHSD6_IS_PTE1: BTB1.4 C82.2 R133.1
hpHSD6_OUT0: C79.2 IC19.12(OUT0_1) IC19.13(OUT0_2) IC19.14(OUT0_3) J7.1 R130.2
hpHSD6_OUT1: C84.2 IC19.8(OUT1_1) IC19.9(OUT1_2) IC19.10(OUT1_3) J7.2 R144.2
I2C0_SCL_PTC8: BTB2.16
I2C0_SDA_PTC9: BTB2.17
I2C1_SCL_PTC28: BTB2.18 IC22.22(SCL) IC23.22(SCL)
I2C1_SDA_PTC29: BTB2.15 IC22.23(SDA) IC23.23(SDA)
IIC1_SCL0: IC22.5(SC0) U1.18
IIC1_SCL1: IC22.7(SC1) U1.22
IIC1_SCL2: IC22.9(SC2) U1.26
IIC1_SCL3: IC22.11(SC3) U1.27
IIC1_SCL4: IC22.14(SC4) U1.23
IIC1_SCL5: IC22.16(SC5) U1.19
IIC1_SCL6: IC22.18(SC6) U1.15
IIC1_SCL7: IC22.20(SC7)
IIC1_SCL8: IC23.5(SC0) U1.2
IIC1_SCL9: IC23.7(SC1) U1.6
IIC1_SCL10: IC23.9(SC2) U1.10
IIC1_SCL11: IC23.11(SC3) U1.14
IIC1_SCL12: IC23.14(SC4) U1.11
IIC1_SCL13: IC23.16(SC5) U1.7
IIC1_SCL14: IC23.18(SC6) U1.3
IIC1_SCL15: IC23.20(SC7)
IIC1_SDA0: IC22.4(SD0) U1.16
IIC1_SDA1: IC22.6(SD1) U1.20
IIC1_SDA2: IC22.8(SD2) U1.24
IIC1_SDA3: IC22.10(SD3) U1.28
IIC1_SDA4: IC22.13(SD4) U1.25
IIC1_SDA5: IC22.15(SD5) U1.21
IIC1_SDA6: IC22.17(SD6) U1.17
IIC1_SDA7: IC22.19(SD7)
IIC1_SDA8: IC23.4(SD0) U1.1
IIC1_SDA9: IC23.6(SD1) U1.4
IIC1_SDA10: IC23.8(SD2) U1.8
IIC1_SDA11: IC23.10(SD3) U1.12
IIC1_SDA12: IC23.13(SD4) U1.13
IIC1_SDA13: IC23.15(SD5) U1.9
IIC1_SDA14: IC23.17(SD6) U1.5
IIC1_SDA15: IC23.19(SD7)
LED0_PTD10: BTB2.56 LED2.2(K)
lpHSD1_DSEL0_PTC12: BTB2.36 R15.1
lpHSD1_DSEL1_PTC21: BTB2.33 R24.1
lpHSD1_IN0_PTC13: BTB2.38 R2.1
lpHSD1_IN1_PTC18: BTB2.37 R6.1
lpHSD1_IN2_PTC19: BTB2.35 R18.1
lpHSD1_IN3_PTC20: BTB2.34 R21.1
lpHSD1_IS_PTB1: BTB2.27 C10.2 R12.1
lpHSD1_OUT0: C5.2 C7.2 D2.1(K) IC1.7(VIN) IC4.24(OUT0) J5.1 J5.2 J6.1 J6.2 J7.34 R3.2
lpHSD1_OUT1: C9.2 IC4.20(OUT1) J7.33 J10.1 J10.2 J13.1 J13.2 R13.2
lpHSD1_OUT2: C12.2 IC4.17(OUT2) J7.32 J12.1 J12.2 J16.1 J16.2 R22.2
lpHSD1_OUT3: C16.2 IC4.13(OUT3) J7.31 J15.1 J15.2 J18.1 J18.2 R25.2
lpHSD2_DSEL0_PTB27: BTB2.42 R46.1
lpHSD2_DSEL1_PTB29: BTB2.39 R52.1
lpHSD2_IN0_PTB25: BTB2.44 R33.1
lpHSD2_IN1_PTB3: BTB2.43 R41.1
lpHSD2_IN2_PTB28: BTB2.41 R49.1
lpHSD2_IN3_PTB2: BTB2.40 R50.1
lpHSD2_IS_PTB0: BTB2.19 C30.2 R44.1
lpHSD2_OUT0: C17.2 C23.2 D9.1(K) IC2.7(VIN) IC7.24(OUT0) J7.21 J11.1 J11.2 J14.1 J14.2 R35.2
lpHSD2_OUT1: C29.2 IC7.20(OUT1) J7.22 J26.1 J26.2 J28.1 J28.2 R45.2
lpHSD2_OUT2: C31.2 IC7.17(OUT2) J7.23 J27.1 J27.2 J32.1 J32.2 R51.2
lpHSD2_OUT3: C33.2 IC7.13(OUT3) J7.35 J31.1 J31.2 J36.1 J36.2 R53.2
lpHSD3_DSEL0_PTE17: BTB1.16 R73.1
lpHSD3_DSEL1_PTE2: BTB1.13 R78.1
lpHSD3_IN0_PTA0: BTB1.21 R65.1
lpHSD3_IN1_PTD30: BTB1.20 R68.1
lpHSD3_IN2_PTE18: BTB1.15 R75.1
lpHSD3_IN3_PTE6: BTB1.14 R76.1
lpHSD3_IS_PTD31: BTB1.19 C48.2 R70.1
lpHSD3_OUT0: C25.2 C42.2 D15.1(K) IC5.7(VIN) IC11.24(OUT0) J7.17 J24.1 J24.2 J25.1 J25.2 R66.2
lpHSD3_OUT1: C45.2 IC11.20(OUT1) J7.18 J39.1 J39.2 J43.1 J43.2 R71.2
lpHSD3_OUT2: C50.2 IC11.17(OUT2) J7.19 J42.1 J42.2 J45.1 J45.2 R77.2
lpHSD3_OUT3: C51.2 IC11.13(OUT3) J7.20 J44.1 J44.2 J46.1 J46.2 R82.2
lpHSD4_DSEL0_PTD27: BTB1.26 R98.1
lpHSD4_DSEL1_PTD29: BTB1.22 R109.1
lpHSD4_IN0_PTB9: BTB1.28 R90.1
lpHSD4_IN1_PTD26: BTB1.27 R93.1
lpHSD4_IN2_PTB8: BTB1.25 R101.1
lpHSD4_IN3_PTA1: BTB1.23 R104.1
lpHSD4_IS_PTD28: BTB1.24 C62.2 R96.1
lpHSD4_OUT0: C36.2 C56.2 D19.1(K) IC8.7(VIN) IC16.24(OUT0) J7.13 J30.1 J30.2 J35.1 J35.2 R91.2
lpHSD4_OUT1: C61.2 IC16.20(OUT1) J7.14 J49.1 J49.2 J51.1 J51.2 R97.2
lpHSD4_OUT2: C63.2 IC16.17(OUT2) J7.15 J50.1 J50.2 J53.1 J53.2 R105.2
lpHSD4_OUT3: C73.2 IC16.13(OUT3) J7.16 J52.1 J52.2 J54.1 J54.2 R115.2
lpHSD5_DSEL0_PTA3: BTB1.36 R134.1
lpHSD5_DSEL1_PTB10: BTB1.29 R145.1
lpHSD5_IN0_PTD24: BTB1.38 R121.1
lpHSD5_IN1_PTA2: BTB1.37 R126.1
lpHSD5_IN2_PTD23: BTB1.35 R139.1
lpHSD5_IN3_PTD2: BTB1.34 R142.1
lpHSD5_IS_PTD3: BTB1.33 C81.2 R131.1
lpHSD5_OUT0: C46.2 C78.2 D24.1(K) IC10.7(VIN) IC20.24(OUT0) J7.27 J38.1 J38.2 J40.1 J40.2 R123.2
lpHSD5_OUT1: C80.2 IC20.20(OUT1) J7.26 J57.1 J57.2 J59.1 J59.2 R132.2
lpHSD5_OUT2: C83.2 IC20.17(OUT2) J7.25 J58.1 J58.2 J61.1 J61.2 R143.2
lpHSD5_OUT3: C85.2 IC20.13(OUT3) J7.24 J60.1 J60.2 J62.1 J62.2 R149.2
LPUART0_RX_PTC3: BTB2.60
LPUART0_TX_PTC2: BTB2.59
LPUART1_RX_PTC6: BTB1.17
LPUART1_RX_PTC6_H: J19.15
LPUART1_TX_PTC7: BTB1.18
LPUART1_TX_PTC7_H: J19.8
LPUART14_RX_PTB21: BTB2.2
LPUART14_RX_PTB21_H: J19.7
LPUART14_TX_PTB20: BTB2.1
LPUART14_TX_PTB20_H: J19.14
OE1_PTB5: BTB2.4
OE2_PTD15: BTB2.6
OE3_PTD17: BTB2.8
OE4_PTE12: BTB2.10
OE5_PTE14: BTB2.12
OE6_PTC31: BTB2.14
PCAN_H: IC24.7(CANH) J19.19 R165.2
PCAN_L: IC24.6(CANL) J19.11 R165.1
PTA24: BTB1.49
PTA25: BTB1.48
PTC10: BTB2.25
PTC10_H: J19.6
PTC11: BTB2.23
PTC11_H: J19.13
PTC24: BTB2.21
PTC24_H: J19.21
PTC25: BTB2.22
PTC25_H: J19.20
PTC26: BTB2.24
PTC26_H: J19.12
PTC27: BTB2.26
PTC27_H: J19.5
PTD9: BTB2.53
PTD11: BTB2.57
Vbat2_IN: C87.2 E4.2 E6.1 R153.1 R157.2
VBATSensor_PTC23: BTB2.20 C86.2 E3.2 E5.1 R151.1 R156.2
VCU_Bootloader: J19.18 SW1.2 SW1.5
Vvar1_Ctrl_PTE8: BTB2.3
Vvar2_Ctrl_PTB4: BTB2.5
Vvar3_Ctrl_PTD16: BTB2.7
Vvar4_Ctrl_PTA28: BTB2.9
Vvar5_Ctrl_PTE3: BTB2.11
Vvar6_Ctrl_PTE7: BTB2.13
NetC2_1: C2.1 IC1.1(BOOT)
NetC2_2: C2.2 D3.1(K) IC1.8(PH) L1.1
NetC3_1: C3.1(+) C6.2 D2.2(A) L1.2 R1.1
NetC14_1: C14.1 IC2.1(BOOT)
NetC14_2: C14.2 D10.1(K) IC2.8(PH) L3.1
NetC15_1: C15.1(+) C18.2 D9.2(A) L3.2 R26.1
NetC22_1: C22.1 IC5.1(BOOT)
NetC22_2: C22.2 D16.1(K) IC5.8(PH) L4.1
NetC24_1: C24.1(+) C26.2 D15.2(A) L4.2 R38.1
NetC34_1: C34.1 IC8.1(BOOT)
NetC34_2: C34.2 D20.1(K) IC8.8(PH) L5.1
NetC35_1: C35.1(+) C37.2 D19.2(A) L5.2 R54.1
NetC43_1: C43.1 IC10.1(BOOT)
NetC43_2: C43.2 D25.1(K) IC10.8(PH) L6.1
NetC44_1: C44.1(+) C47.2 D24.2(A) L6.2 R72.1
NetC57_1: C57.1 IC14.1(BOOT)
NetC57_2: C57.2 D31.1(K) IC14.8(PH) L7.1
NetC65_2: C65.2 C66.2 F3.1 IC15.1(EN) IC15.2(IN)
NetC70_2: C70.2 C71.2 F4.1 IC13.3(VIN)
NetD5_1: D5.1(A) R4.1
NetD6_1: D6.1(A) R5.1
NetD11_2: D11.2(A) K1.5(COIL_1) Q1.3(D)
NetD14_1: D14.1(A) R29.1
NetD17_1: D17.1(A) R37.1
NetD21_1: D21.1(A) R55.1
NetD23_1: D23.1(A) R67.1
NetD27_1: D27.1(A) R80.1
NetD29_1: D29.1(A) R92.1
NetD32_1: D32.1(A) R99.1
NetD35_1: D35.1(A) R124.1
NetD36_1: D36.1(A) R125.1
NetFU1_2: FU1.2 J8.1 J8.2 L2.1
NetFU2_2: FU2.2 K1.3(COM_1) K1.4(COM_2)
NetIC1_4: IC1.4(VSENSE) R1.2 R7.2
NetIC2_4: IC2.4(VSENSE) R26.2 R27.2
NetIC3_1: IC3.1(GND) R5.2
NetIC3_2: IC3.2(IN0) R8.2
NetIC3_3: IC3.3(DEN) R10.2
NetIC3_4: IC3.4(IS) R14.2 R19.1
NetIC3_5: IC3.5(DSEL) R16.2
NetIC3_6: IC3.6(IN1) R20.2
NetIC4_2: IC4.2(IN0) R2.2
NetIC4_4: IC4.4(GND) R4.2
NetIC4_5: IC4.5(IN1) R6.2
NetIC4_6: IC4.6(DEN) R9.2
NetIC4_7: IC4.7(IS) R12.2 R17.1
NetIC4_8: IC4.8(DSEL0) R15.2
NetIC4_9: IC4.9(IN2) R18.2
NetIC4_10: IC4.10(IN3) R21.2
NetIC4_11: IC4.11(DSEL1) R24.2
NetIC5_4: IC5.4(VSENSE) R38.2 R47.2
NetIC6_1: IC6.1(GND) R29.2
NetIC6_2: IC6.2(IN0) R30.2
NetIC6_3: IC6.3(DEN) R31.2
NetIC6_4: IC6.4(IS) R34.2 R39.1
NetIC6_5: IC6.5(DSEL) R36.2
NetIC6_6: IC6.6(IN1) R40.2
NetIC7_2: IC7.2(IN0) R33.2
NetIC7_4: IC7.4(GND) R37.2
NetIC7_5: IC7.5(IN1) R41.2
NetIC7_6: IC7.6(DEN) R43.2
NetIC7_7: IC7.7(IS) R44.2 R48.1
NetIC7_8: IC7.8(DSEL0) R46.2
NetIC7_9: IC7.9(IN2) R49.2
NetIC7_10: IC7.10(IN3) R50.2
NetIC7_11: IC7.11(DSEL1) R52.2
NetIC8_4: IC8.4(VSENSE) R54.2 R60.2
NetIC9_1: IC9.1(GND) R55.2
NetIC9_2: IC9.2(IN0) R56.2
NetIC9_3: IC9.3(DEN) R57.2
NetIC9_4: IC9.4(IS) R59.2 R62.1
NetIC9_5: IC9.5(DSEL) R61.2
NetIC9_6: IC9.6(IN1) R63.2
NetIC10_4: IC10.4(VSENSE) R72.2 R79.2
NetIC11_2: IC11.2(IN0) R65.2
NetIC11_4: IC11.4(GND) R67.2
NetIC11_5: IC11.5(IN1) R68.2
NetIC11_6: IC11.6(DEN) R69.2
NetIC11_7: IC11.7(IS) R70.2 R74.1
NetIC11_8: IC11.8(DSEL0) R73.2
NetIC11_9: IC11.9(IN2) R75.2
NetIC11_10: IC11.10(IN3) R76.2
NetIC11_11: IC11.11(DSEL1) R78.2
NetIC12_1: IC12.1(GND) R80.2
NetIC12_2: IC12.2(IN0) R81.2
NetIC12_3: IC12.3(DEN) R83.2
NetIC12_4: IC12.4(IS) R85.2 R87.1
NetIC12_5: IC12.5(DSEL) R86.2
NetIC12_6: IC12.6(IN1) R88.2
NetIC14_4: IC14.4(VSENSE) R94.2 R103.2
NetIC15_5: IC15.5(ADJ) R108.2 R114.2
NetIC16_2: IC16.2(IN0) R90.2
NetIC16_4: IC16.4(GND) R92.2
NetIC16_5: IC16.5(IN1) R93.2
NetIC16_6: IC16.6(DEN) R95.2
NetIC16_7: IC16.7(IS) R96.2 R100.1
NetIC16_8: IC16.8(DSEL0) R98.2
NetIC16_9: IC16.9(IN2) R101.2
NetIC16_10: IC16.10(IN3) R104.2
NetIC16_11: IC16.11(DSEL1) R109.2
NetIC17_1: IC17.1(GND) R99.2
NetIC17_2: IC17.2(IN0) R102.2
NetIC17_3: IC17.3(DEN) R106.2
NetIC17_4: IC17.4(IS) R110.2 R112.1
NetIC17_5: IC17.5(DSEL) R111.2
NetIC17_6: IC17.6(IN1) R113.2
NetIC18_4: IC18.4(IN+) R122.1
NetIC18_5: IC18.5(IN-) R117.1
NetIC19_1: IC19.1(GND) R125.2
NetIC19_2: IC19.2(IN0) R127.2
NetIC19_3: IC19.3(DEN) R129.2
NetIC19_4: IC19.4(IS) R133.2 R140.1
NetIC19_5: IC19.5(DSEL) R135.2
NetIC19_6: IC19.6(IN1) R141.2
NetIC20_2: IC20.2(IN0) R121.2
NetIC20_4: IC20.4(GND) R124.2
NetIC20_5: IC20.5(IN1) R126.2
NetIC20_6: IC20.6(DEN) R128.2
NetIC20_7: IC20.7(IS) R131.2 R138.1
NetIC20_8: IC20.8(DSEL0) R134.2
NetIC20_9: IC20.9(IN2) R139.2
NetIC20_10: IC20.10(IN3) R142.2
NetIC20_11: IC20.11(DSEL1) R145.2
NetIC21_3: IC21.3(D) Q2.4(G) R146.1
NetIC22_3: IC22.3(~{RESET}) R162.2
NetIC23_3: IC23.3(~{RESET}) R161.2
NetLED1_1: LED1.1(A) R163.1
NetLED2_1: LED2.1(A) R166.1
NetR150_1: R150.1 R151.2
NetR152_1: R152.1 R153.2

Not connected (* = marked no-connect by the designer): BTB1 32; BTB2 28; D5 2; D6 2; D14 2; D17 2; D21 2; D23 2; D27 2; D29 2; D32 2; D35 2; D36 2; IC1 2(NC_1) 3(NC_2) 5(ENA); IC2 2(NC_1) 3(NC_2) 5(ENA); IC3 7(NC_1) 11(NC_2); IC4 1(NC_1) 3(NC_2) 12(NC_3) 14(NC_4) 15(NC_5) 16(NC_6) 18(NC_7) 19(NC_8) 21(NC_9) 22(NC_10) 23(NC_11); IC5 2(NC_1) 3(NC_2) 5(ENA); IC6 7(NC_1) 11(NC_2); IC7 1(NC_1) 3(NC_2) 12(NC_3) 14(NC_4) 15(NC_5) 16(NC_6) 18(NC_7) 19(NC_8) 21(NC_9) 22(NC_10) 23(NC_11); IC8 2(NC_1) 3(NC_2) 5(ENA); IC9 7(NC_1) 11(NC_2); IC10 2(NC_1) 3(NC_2) 5(ENA); IC11 1(NC_1) 3(NC_2) 12(NC_3) 14(NC_4) 15(NC_5) 16(NC_6) 18(NC_7) 19(NC_8) 21(NC_9) 22(NC_10) 23(NC_11); IC12 7(NC_1) 11(NC_2); IC14 2(NC_1) 3(NC_2) 5(ENA); IC15 6(TAB); IC16 1(NC_1) 3(NC_2) 12(NC_3) 14(NC_4) 15(NC_5) 16(NC_6) 18(NC_7) 19(NC_8) 21(NC_9) 22(NC_10) 23(NC_11); IC17 7(NC_1) 11(NC_2); IC19 7(NC_1) 11(NC_2); IC20 1(NC_1) 3(NC_2) 12(NC_3) 14(NC_4) 15(NC_5) 16(NC_6) 18(NC_7) 19(NC_8) 21(NC_9) 22(NC_10) 23(NC_11); J7 28 29 MH1 MH2 MH3 MH4; SW1 1 3

## Notes on the sheet
- 接地考虑PCB通过过孔压螺栓接低
- 再检查是不是母头，接口有没有反
- (near J5) 切换24V输出
- 输入6mil|2ma IS10mil|50ma GND8mil|120ma
- (near J1) 载流走线
- 默认开启诊断，使能DEN
- 连接至低压主开关
- 载流走线
- (near D2) 实际输出电压12.0263V
- PUMP_PWR
- L4_12V_Backup
- 要求30V以上耐压
- PUMP_FAN1_PWR
- BACKUP_FAN_PWR
- H3_24V_Backup
- DRS_PWR_8V
- H4_24V_Backup
- H5_24V_Backup
- MCU_UBR
- VCU_PWR
- FIREON_PWR
- ENERGE_METER_PWR
- TSALR_PWR
- L5_5V_Backup
- (near J8) 载流走线
- 带充电接口？
- (near J9) 加总滤波电容
- (near R1) 分压电阻待确定
- IL+_PWR
- VCU_UBR
- ACCU_FAN_PWR
- H2_24V_Backup
- (near J7) 预留 可飞线
- Temperature_PWR
- L2_24V_Backup
- ACCU_UBR
- ACCU_PWR
- BDU_PWR
- L1_5V_Backup
- H1_24V_Backup
- BSPD_PWR
- DSBD_PWR
- LOGGER_PWR
- L6_12V_Backup
- (near D9) 实际输出电压12.0263V
- L3_24V_Backup
- BUZZER_PWRpwm
- TAILLIGHT_PWR
- 功率输出
- 考虑大电流短路情况¦不可能经常换
- 线位移传感器接口
- (near R26) 分压电阻待确定
- DRS PWM控制接口
- BCAN接口
- PCAN接口
- VCU_Bootloader
- 3.3V输出供电¦最大1A
- 惯导串口
- (near D15) 实际输出电压8.0043V
- (near F1) 290ma跳闸保险丝
- 逻辑信号
- (near R38) 分压电阻待确定
- 改为28PIN
- ECU接插件
- IIC传感器接口
- (near D19) 实际输出电压5.0727V
- (near J34) 多10
- 10bit ADC*4 PWM SPI*1 UART*2
- (near R54) 分压电阻待确定
- ADC0_S15
- Text
- ADC2_S23
- ADC2_S22
- ADC0_S20
- ADC0_S17
- ADC0_S21
- 单调
- (near D24) 实际输出电压5.0727V
- ADC0_S14
- IIC0给EEPROM
- 分隔
- 只能输入
- (near R72) 分压电阻待确定
- 12bit ADC*6|PWM*6|SPI4
- 接4G模块
- 输出电容10TPB330M也可考虑替换型号：HV1V337M1010PZ 330uF 耐压35V 等效串联电阻32mΩ，但体积太大了放弃
- 考虑输出不小心短接输出到24V、电流反灌，加了反接二极管
- SS54B：正向压降550mV@5A 整流电流5A 直流反向耐压40V
- (near BTB2) BTB连接器¦连接核心板
- 功率电感换为YSPI1040TP-220M，22uF，额定电流6A，饱和电流9A(借用了SDRH104R-3R3NT的封装)
- 指示正常上VBAT和核心板电源正常供电
- 电源采用原方案
- (near F3) 载流重选
- (near F4) 至少1.3V压降才有1A输出能力
- (near F3) 与3.3V电源共TVS输入保护
- 3.8V电源
- 仪表激活按钮按下且上了高压（AIR）才能成功激活，闭合激活继电器，安全回路上电
- 无误？
- 激活信号接口¦去往高压盒
- 激活继电器
- (near R136) 线位移传感器信号处理
- (near Q2) D
- 建议加MOS管管理ADC采集
- 预留，不接
- Nmos最大漏源电压VDSS=60V
- (near Q2) S
- 最大量程16.5V¦防止通道过压
- (near Q2) Vth=-1.5V
- 截止：Vgs=0V
- 饱和导通：Vgs=-24V；Vds=-24V
- Vgs​>Vth​
- 分压电阻未改
- Vds≤Vgs−Vth    Vgs​<Vth​
- 自激电路¦MOS管驱动
- ESD防护¦其3.3V下等效电阻330K欧，击穿电压5V
- (near R159) 电阻值视情况而定
- 模拟激活按钮闭合，闭合安全回路¦仪表端通过CAN报文实现激活操作
- 电源指示灯
- (near IC23) 不能5V供电，最好3.3V
- 工作指示灯
- BCAN收发器
- PCAN收发器
- 调试CAN收发器¦TJA1042T 支持FDCAN
- ENGINE:
- DATE
- Vehicle Number:
- E10
- Formula Student Electric Racing Team
- Wuhan University of Techonology
- No. 122, Luoshi Road, Wuhan
- Hubei Provence, China
- BOM:
- DESIGN:
- CHECK:
- REFERENCE DOCUMENTS
- TITLE
- ProjectName:
- Revision:
- ASSY DWG:
- FAB DWG:
- PCB DWG:
- A1
- SIZE
- FileName
- WUTE racing team
- SHEET
- OF
- REV

## Library data of the parts
BTB1 BTB2 = BTB_0.8mm_60Pin_Mother: System: Connector
C1 C2 C4 C7-C14 C16 C19-C23 C27-C34 C38-C43 C45 C48-C58 C61-C64 C72-C76 C78-C89 = C0603: Capacitor CC0603KRX7R9BB104; Manufacturer_Name: YAGEO; Datasheet Link: https://componentsearchengine.com/Datasheets/2/CC0603KRX7R9BB104.pdf; Height: 0.9mm; Manufacturer_Part_Number: CC0603KRX7R9BB104; Mouser Part Number: 603-CC603KRX7R9BB104; Mouser Price/Stock: https://www.mouser.co.uk/ProductDetail/YAGEO/CC0603KRX7R9BB104?qs=vTakOoo5QyLvVCYM2ge8LQ%3D%3D; Arrow Part Number: CC0603KRX7R9BB104; Arrow Price/Stock: https://www.arrow.com/en/products/cc0603krx7r9bb104/yageo?region=europe
C3 C15 = TAJE337M016RNJ: Capacitor Polarised; Manufacturer_Name: Kyocera AVX; Datasheet Link: http://datasheets.avx.com/TAJ.pdf; Height: 4.3mm; Manufacturer_Part_Number: TAJE337M016RNJ; Mouser Part Number: 581-TAJE337M016RNJ; Mouser Price/Stock: https://www.mouser.co.uk/ProductDetail/AVX/TAJE337M016RNJ?qs=y3iDra2JAa8YWVPUw61OpA%3D%3D; Arrow Part Number: TAJE337M016RNJ; Arrow Price/Stock: null?region=asia
C5 C17 C25 C36 C46 C60 = C0805: Capacitor; Manufacturer_Name: YAGEO; Manufacturer_Part_Number: CC0805KRX7R9BB104; Datasheet Link: https://www.yageo.com/upload/media/product/productsearch/datasheet/mlcc/UPY-GPHC_X7R_6.3V-to-50V_20.pdf; Height: 0.95mm; Mouser Part Number: 603-CC805KRX7R9BB104; Mouser Price/Stock: https://www.mouser.co.uk/ProductDetail/YAGEO/CC0805KRX7R9BB104?qs=vTakOoo5QyLx0lXWgVtRhQ%3D%3D; Arrow Part Number: CC0805KRX7R9BB104; Arrow Price/Stock: https://www.arrow.com/en/products/cc0805krx7r9bb104/yageo?region=nac
C6 C18 C26 C37 C47 C65-C71 C77 = C0603: Capacitor; Manufacturer_Name: YAGEO; Manufacturer_Part_Number: CC0603KRX7R9BB104; Datasheet Link: https://componentsearchengine.com/Datasheets/2/CC0603KRX7R9BB104.pdf; Height: 0.9mm; Mouser Part Number: 603-CC603KRX7R9BB104; Mouser Price/Stock: https://www.mouser.co.uk/ProductDetail/YAGEO/CC0603KRX7R9BB104?qs=vTakOoo5QyLvVCYM2ge8LQ%3D%3D; Arrow Part Number: CC0603KRX7R9BB104; Arrow Price/Stock: https://www.arrow.com/en/products/cc0603krx7r9bb104/yageo?region=europe
C24 C35 C44 C59 = 10TPB330M: Capacitor Polarised; Manufacturer_Name: Panasonic; Datasheet Link: http://industrial.panasonic.com/cdbs/www-data/pdf/AAA8000/AAA8000C65.pdf; Manufacturer_Part_Number: 10TPB330M; Mouser Part Number: 667-10TPB330M; Mouser Price/Stock: https://www.mouser.co.uk/ProductDetail/Panasonic/10TPB330M?qs=OE1iw1LrrPGJ%2FhG9UwG4gg%3D%3D; Arrow Part Number: 10TPB330M; Arrow Price/Stock: https://www.arrow.com/en/products/10tpb330m/panasonic?region=nac
CN3 CN4 = ZX-XH2.54-3PZZ: Manufacturer: Megastar(兆星); Add into BOM: yes; Pins Structure: 1x3P; Pitch: 2.54mm; Reference Series: XH; Number of PINs Per Row: 3; Current Rating (Max): 3A; Symbol: ZX-XH2.54-3PZZ; Device: ZX-XH2.54-3PZZ; LCSC Part Name: ZX-XH2.54-3PZZ; Supplier Part: C7429633; Manufacturer Part: ZX-XH2.54-3PZZ; Supplier Footprint: 插件,P=2.54mm; JLCPCB Part Class: Extended Part; Datasheet: https://atta.szlcsc.com/upload/public/pdf/source/20230619/AE17037A2CFDBE8D9CBA775D61AD0A84.pdf; Supplier: LCSC; Convert to PCB: yes; Mounting Style: 直插; Number of Pins: 3P; Number of Rows: 1; Row Spacing: -; Contact Material: 黄铜; Contact Plating: 锡; Operating Temperature Range: -25℃~+85℃
D1 D4 D12 D13 D18 D22 D26 D28 D30 D33 D34 = SMAJ58CA: TVS Diode (Bi-directional); Manufacturer_Name: LITTELFUSE; Datasheet Link: http://www.littelfuse.com/~/media/electronics/datasheets/tvs_diodes/littelfuse_tvs_diode_smaj_datasheet.pdf.pdf; Height: 2.29mm; Manufacturer_Part_Number: SMAJ58CA; Mouser Part Number: 576-SMAJ58CA; Mouser Price/Stock: https://www.mouser.co.uk/ProductDetail/Littelfuse/SMAJ58CA?qs=zHiv0nsVGmqWEBj8DDvFYg%3D%3D; Arrow Part Number: SMAJ58CA; Arrow Price/Stock: https://www.arrow.com/en/products/smaj58ca/littelfuse?region=nac
D2 D9 D15 D19 D24 = SS54B: Diode; Manufacturer_Name: HY Electronic; Datasheet Link: https://datasheet.datasheetarchive.com/originals/distributors/Datasheets-3/DSA-43270.pdf; Height: 2.44mm; Manufacturer_Part_Number: SS54B
D3 D10 D16 D20 D25 D31 = B540C-13-F: Diode; Manufacturer_Name: Diodes Incorporated; Datasheet Link: https://componentsearchengine.com/Datasheets/2/B540C-13-F.pdf; Height: 2.5mm; Manufacturer_Part_Number: B540C-13-F; Mouser Part Number: 621-B540C-F; Mouser Price/Stock: https://www.mouser.co.uk/ProductDetail/Diodes-Incorporated/B540C-13-F?qs=v2dnQLbuoRZXHN%2FK4ft5%252Bg%3D%3D; Arrow Part Number: B540C-13-F; Arrow Price/Stock: https://www.arrow.com/en/products/b540c-13-f/diodes-incorporated?region=nac
D5 D6 D14 D17 D21 D23 D27 D29 D32 D35 D36 = BAS21,215: Diode; Manufacturer_Name: Nexperia; Datasheet Link: https://assets.nexperia.com/documents/data-sheet/BAS21.pdf; Height: 1.1mm; Manufacturer_Part_Number: BAS21,215; Mouser Part Number: 771-BAS21-T/R; Mouser Price/Stock: https://www.mouser.co.uk/ProductDetail/Nexperia/BAS21215?qs=me8TqzrmIYVAUvbefFMRnQ%3D%3D; Arrow Part Number: BAS21,215; Arrow Price/Stock: https://www.arrow.com/en/products/bas21215/nexperia
D7 = M7: Diode C2902910; Manufacturer_Name: Wurth Elektronik; Manufacturer_Part_Number: 824500850; Datasheet Link: https://datasheet.datasheetarchive.com/originals/distributors/DKDS-9/170649.pdf; Height: 2.5mm; Mouser Part Number: 710-824500850; Mouser Price/Stock: http://www.mouser.com/Search/ProductDetail.aspx?qs=16w8nSHsg3sA6biQsu7wzg%3d%3d
D8 = SMAJ28CA: TVS Diode (Bi-directional); Manufacturer_Name: Bourns; Datasheet Link: https://www.bourns.com/data/global/pdfs/SMAJ.pdf; Height: 2.62mm; Manufacturer_Part_Number: SMAJ28CA; Mouser Part Number: 652-SMAJ28CA; Mouser Price/Stock: https://www.mouser.co.uk/ProductDetail/Bourns/SMAJ28CA?qs=A3H9pljuJ8Rc2FOBsYvsOw%3D%3D; Arrow Part Number: SMAJ28CA; Arrow Price/Stock: https://www.arrow.com/en/products/smaj28ca/bourns?utm_currency=USD&region=nac
D11 = SS34A: Diode; Manufacturer_Name: HY Electronic; Datasheet Link: https://datasheet.datasheetarchive.com/originals/distributors/Datasheets-3/DSA-43252.pdf; Height: 2.62mm; Manufacturer_Part_Number: SS34A
E1 = CESD5V0D3 ZA: Manufacturer: CJ(江苏长电/长晶); Add into BOM: yes; Polarity: 单向; Breakdown Voltage (VBR): 6.2V; Peak Pulse Current(Ipp)@8/20us: 15A; Reverse Stand-Off Voltage (Vrwm): 5V; Clamping Voltage@Ipp: 15.5V; Name: CESD5V0D3 ZA; Symbol: CESD5V0D3 ZA; Device: CESD5V0D3 ZA; LCSC Part Name: 单向ESD; Supplier Part: C22643; Manufacturer Part: CESD5V0D3 ZA; Supplier Footprint: SOD-323; JLCPCB Part Class: Extended Part; Datasheet: https://atta.szlcsc.com/upload/public/pdf/source/20140301/1457707004115.pdf; Supplier: LCSC; Convert to PCB: yes
E2-E6 = CESD3V3D3 YU: 极性:单向;反向截止电压(Vrwm):3.3V;击穿电压(VBR):5V;钳位电压(Vc)@Ipp:13V;; Manufacturer: CJ(江苏长电/长晶); Add into BOM: yes; Polarity: 单向; Reverse Stand-Off Voltage (Vrwm): 3.3V; Breakdown Voltage (VBR): 5V; Peak Pulse Current(Ipp)@8/20us: 16A; Clamping Voltage@Ipp: 13V; Name: CESD3V3D3 YU; Symbol: CESD3V3D3; Device: CESD3V3D3 YU; LCSC Part Name: 单向ESD; Supplier Part: C38388; Manufacturer Part: CESD3V3D3 YU; Supplier Footprint: SOD-323; Datasheet: https://atta.szlcsc.com/upload/public/pdf/source/20150915/1457707371129.pdf; Supplier: LCSC; Convert to PCB: yes
F1-F4 = R1206: Manufacturer_Name: UNI-ROYAL(Uniroyal Elec); Manufacturer_Part_Number: 1206W4F1002T5E; Datasheet Link: https://datasheet.lcsc.com/szlcsc/Uniroyal-Elec-1206W4F1002T5E_C17902.pdf; Height: 0.65mm
FU1 FU2 = XF-506P: 小型汽车插片保险丝座
IC1 IC2 IC5 IC8 IC10 IC14 = TPS5450DDAR: Integrated Circuit; Manufacturer_Name: Texas Instruments; Datasheet Link: http://www.ti.com/general/docs/suppproductinfo.tsp?distId=10&gotoUrl=http%3A%2F%2Fwww.ti.com%2Flit%2Fgpn%2Ftps5450; Height: 1.7mm; Manufacturer_Part_Number: TPS5450DDAR; Mouser Part Number: 595-TPS5450DDAR; Mouser Price/Stock: https://www.mouser.co.uk/ProductDetail/Texas-Instruments/TPS5450DDAR?qs=h%2FYsCRHtaqPaz8oWBdcCug%3D%3D; Arrow Part Number: TPS5450DDAR; Arrow Price/Stock: https://www.arrow.com/en/products/tps5450ddar/texas-instruments?region=nac
IC3 IC6 IC9 IC12 IC17 IC19 = BTT60502ERAXUMA1: Integrated Circuit; Manufacturer_Name: Infineon; Datasheet Link: https://www.infineon.com/dgdl/Infineon-BTT6050-2ERA-DS-v01_00-EN.pdf?fileId=5546d46269e1c019016a21d599df0d6a; Height: 1.15mm; Manufacturer_Part_Number: BTT60502ERAXUMA1; Mouser Part Number: 726-BTT60502ERAXUMA1; Mouser Price/Stock: https://www.mouser.co.uk/ProductDetail/Infineon-Technologies/BTT60502ERAXUMA1?qs=mAH9sUMRCtsi1%2FDCmYjCiw%3D%3D; Arrow Part Number: BTT60502ERAXUMA1; Arrow Price/Stock: https://www.arrow.com/en/products/btt60502eraxuma1/infineon-technologies-ag?region=nac
IC4 IC7 IC11 IC16 IC20 = BTT62004ESAXUMA1: Integrated Circuit; Manufacturer_Name: Infineon; Datasheet Link: https://componentsearchengine.com/Datasheets/2/BTT62004ESAXUMA1.pdf; Height: 1.15mm; Manufacturer_Part_Number: BTT62004ESAXUMA1; Mouser Part Number: 726-BTT62004ESAXUMA1; Mouser Price/Stock: https://www.mouser.co.uk/ProductDetail/Infineon-Technologies/BTT62004ESAXUMA1?qs=unwgFEO1A6tpV1sLwJtTRA%3D%3D; Arrow Part Number: BTT62004ESAXUMA1; Arrow Price/Stock: https://www.arrow.com/en/products/btt62004esaxuma1/infineon-technologies-ag
IC13 = AMS1117-3.3: Integrated Circuit; Manufacturer_Name: Advanced; Datasheet Link: https://datasheet.datasheetarchive.com/originals/distributors/Datasheets-28/DSA-550594.pdf; Height: 1.8mm; Manufacturer_Part_Number: AMS1117-3.3
IC15 = MIC29302WU: Integrated Circuit; Manufacturer_Name: Microchip; Datasheet Link: https://www.mouser.in/datasheet/2/268/MIC2915x_30x_50x_75x_High_Current_Low_Dropout_Regu-1889172.pdf; Height: 5.08mm; Manufacturer_Part_Number: MIC29302WU; Mouser Part Number: 998-MIC29302WU; Mouser Price/Stock: https://www.mouser.co.uk/ProductDetail/Microchip-Technology/MIC29302WU?qs=kh6iOki%2FeLGH5fS1ZBQ3pA%3D%3D; Arrow Part Number: MIC29302WU; Arrow Price/Stock: https://www.arrow.com/en/products/mic29302wu/microchip-technology?region=nac
IC18 = INA199A1DCKR: Integrated Circuit; Manufacturer_Name: Texas Instruments; Datasheet Link: http://www.ti.com/lit/ds/symlink/ina199.pdf; Height: 1.1mm; Manufacturer_Part_Number: INA199A1DCKR; Mouser Part Number: 595-INA199A1DCKR; Mouser Price/Stock: https://www.mouser.co.uk/ProductDetail/Texas-Instruments/INA199A1DCKR?qs=v3hU%2FV0XOahkyIKIBScY5Q%3D%3D; Arrow Part Number: INA199A1DCKR; Arrow Price/Stock: https://www.arrow.com/en/products/ina199a1dckr/texas-instruments?region=nac
IC21 = 2N7002: Integrated Circuit; Manufacturer_Name: Nylofix; Manufacturer_Part_Number: 2N7002P,235; Datasheet Link: https://4donline.ihs.com/images/VipMasterIC/IC/PHGL/PHGLS21946/PHGLS21946-1.pdf?hkey=EF798316E3902B6ED9A73243A3159BB0; Height: 1.1mm
IC22 IC23 = TCA9548APWR: Integrated Circuit; Manufacturer_Name: Texas Instruments; Datasheet Link: http://www.ti.com/lit/ds/symlink/tca9548a.pdf; Height: 1.2mm; Manufacturer_Part_Number: TCA9548APWR; Mouser Part Number: 595-TCA9548APWR; Mouser Price/Stock: https://www.mouser.co.uk/ProductDetail/Texas-Instruments/TCA9548APWR?qs=iFaFN7AS2WF%252BqSiJMbdYwQ%3D%3D; Arrow Part Number: TCA9548APWR; Arrow Price/Stock: https://www.arrow.com/en/products/tca9548apwr/texas-instruments?region=nac
IC24 IC25 = TJA1042T_3_1J: Integrated Circuit; Manufacturer_Name: NXP; Manufacturer_Part_Number: TJA1042T/3/1J; Datasheet Link: http://www.nxp.com/docs/en/data-sheet/TJA1042.pdf; Height: 1.75mm; Mouser Part Number: 771-TJA1042T/3/1J; Mouser Price/Stock: https://www.mouser.co.uk/ProductDetail/NXP-Semiconductors/TJA1042T-3-1J?qs=gNSudQoqUYC0yGbZKhqwlQ%3D%3D; Arrow Part Number: TJA1042T/3/1J; Arrow Price/Stock: https://www.arrow.com/en/products/tja1042t31j/nxp-semiconductors?utm_currency=USD&region=nac
J2 = XT60PW-M: Connector; Manufacturer_Name: Changzou Amass Elec; Datasheet Link: https://www.tme.eu/Document/9b8d0c5eb7094295f3d3112c214d3ade/XT60PW%20SPEC.pdf; Height: 8.4mm; Manufacturer_Part_Number: XT60PW-M
J5 J11 J24 J30 J38 = QM13.2
J7 = 776231-1: Connector; Manufacturer_Name: TE Connectivity; Datasheet Link: https://www.te.com/commerce/DocumentDelivery/DDEController?Action=srchrtrv&DocNm=1-1773979-2&DocType=Data%20Sheet&DocLang=English&PartCntxt=776231-1&DocFormat=pdf; Height: 34.25mm; Manufacturer_Part_Number: 776231-1; Mouser Part Number: 571-776231-1; Mouser Price/Stock: https://www.mouser.co.uk/ProductDetail/TE-Connectivity/776231-1?qs=YqNA2qefETAQAJm2ankyIA%3D%3D; Arrow Part Number: 776231-1; Arrow Price/Stock: https://www.arrow.com/en/products/776231-1/te-connectivity?region=nac
J19 = 776228-1: Connector; Manufacturer_Name: TE Connectivity; Datasheet Link: https://www.te.com/commerce/DocumentDelivery/DDEController?Action=srchrtrv&DocNm=1-1773979-2&DocType=Data%20Sheet&DocLang=English&PartCntxt=776228-1&DocFormat=pdf; Height: 34.25mm; Manufacturer_Part_Number: 776228-1; Mouser Part Number: 571-776228-1; Mouser Price/Stock: https://www.mouser.co.uk/ProductDetail/TE-Connectivity/776228-1?qs=YqNA2qefETD31MBKizKIJw%3D%3D; Arrow Part Number: 776228-1; Arrow Price/Stock: https://www.arrow.com/en/products/776228-1/te-connectivity?region=europe
J33 J34 = 排针_P2_2.54: Connector; Manufacturer_Name: Ckmtw(Shenzhen Cankemeng); Manufacturer_Part_Number: B-2100S02P-A110; Datasheet Link: https://datasheet.lcsc.com/lcsc/2210192330_Ckmtw-Shenzhen-Cankemeng-B-2100S02P-A110_C124375.pdf; Height: 8.8mm
K1 = HF14FW/024-HSTF: Relay or Contactor; Manufacturer_Name: Hongfa; Datasheet Link: https://docs.rs-online.com/d608/0900766b81663c99.pdf; Height: 26.5mm; Manufacturer_Part_Number: HF14FW/024-HSTF
K2 = HF46F_024-HS1T: Relay or Contactor; Manufacturer_Name: Hongfa; Manufacturer_Part_Number: HF46F/024-HS1T; Datasheet Link: https://www.tme.com/Document/c87786c546bba5bb9984c9460ff2ec46/HF46F_en.pdf; Height: 15.6mm
L1 L3-L7 = YSPI1040TP-220M: Inductor; Manufacturer_Name: TSA; Manufacturer_Part_Number: SDRH104R-3R3NT; Datasheet Link: http://www.tsasun.com/uploadfile/SDRH%20Series.pdf; Height: 4.1mm
L2 = 磁环电感
LED1 LED2 = XL-1606UGC: Manufacturer: XINGLIGHT(成兴光); Add into BOM: yes; Emitted Color: 翠绿色; Power Dissipation: 80mW; Forward Current: 25mA; Dominant Wavelength: 520nm~530nm; Peak Wavelength: 535nm; Lens Color: 无色透明透镜; Viewing Angle: 120°; Mounting Sytle: 侧贴; Symbol: XL-1606UGC; Device: XL-1606UGC; LCSC Part Name: XL-1606UGC; Supplier Part: C965863; Manufacturer Part: XL-1606UGC; Supplier Footprint: SMD,1.1x1.7mm; JLCPCB Part Class: Extended Part; Datasheet: https://atta.szlcsc.com/upload/public/pdf/source/20221102/94FA3AB05D9E652787BBD0AFAAE97065.pdf; Supplier: LCSC; Convert to PCB: yes; Color Temperature: -; Operating Temperature: -30℃~+85℃
Q1 = BSS138P,215: MOSFET (N-Channel); Manufacturer_Name: Nexperia; Datasheet Link: https://assets.nexperia.com/documents/data-sheet/BSS138P.pdf; Height: 1.1mm; Manufacturer_Part_Number: BSS138P,215; Mouser Part Number: 771-BSS138P215; Mouser Price/Stock: https://www.mouser.co.uk/ProductDetail/Nexperia/BSS138P215?qs=A1cBxND5mHJyVAOcRahidg%3D%3D; Arrow Part Number: BSS138P,215; Arrow Price/Stock: https://www.arrow.com/en/products/bss138p215/nexperia?utm_currency=USD&region=europe
Q2 = 4409_C2922759: Manufacturer: KUU; Symbol: 4409.0; Add into BOM: yes; Type: 1个P沟道; Drain Source Voltage (Vdss): 30V; Continuous Drain Current (Id): 15A; Drain Source On Resistance (RDS(on)@Vgs,Id): 12mΩ@10V; Power Dissipation (Pd): 3.1W; Gate Threshold Voltage (Vgs(th)@Id): 1V@250uA; Total Gate Charge (Qg@Vgs): 48nC@10V; Input Capacitance (Ciss@Vds): 2.9nF; Reverse Transfer Capacitance (Crss@Vds): 280pF; Device: 4409_C2922759; LCSC Part Name: P沟道增强型功率MOSFET,电流:-15A,耐压:-30V; Supplier Part: C2922759; Manufacturer Part: 4409; Supplier Footprint: SOP-8; JLCPCB Part Class: Extended Part; Datasheet: https://atta.szlcsc.com/upload/public/pdf/source/20211122/144BE14CBC32E189D90AEB5AEC599EE3.pdf; Supplier: LCSC; Convert to PCB: yes; Operating Temperature: -55℃~+150℃
R1-R27 R29-R107 R109-R113 R115 R116 R121 R123-R135 R138-R145 R149-R153 R156 R157 R161-R166 = R0603: Resistor 0603WAF1002T5E; Manufacturer_Name: UNI-ROYAL(Uniroyal Elec); Datasheet Link: https://datasheet.lcsc.com/szlcsc/Uniroyal-Elec-0603WAF1002T5E_C25804.pdf; Height: 0.55mm; Manufacturer_Part_Number: 0603WAF1002T5E
R28 R108 R114 R117-R119 R122 R136 R137 R146-R148 R154 R155 R158-R160 = R0603: Resistor; Manufacturer_Name: UNI-ROYAL(Uniroyal Elec); Manufacturer_Part_Number: 0603WAF1002T5E; Datasheet Link: https://datasheet.lcsc.com/szlcsc/Uniroyal-Elec-0603WAF1002T5E_C25804.pdf; Height: 0.55mm
R120 = R2512: C5375459 HoYLR2512-3W-3mR-1%
SW1 = XKB5858-Z-E: Manufacturer: XKB Connection(中国星坤); Add into BOM: yes; Self Lock / No Lock: 自锁; Actuator Style: 方形按钮; Contact Current: 100mA; Voltage Rating (AC): 250V; Voltage Rating (DC): 30V; Insulation Resistance: 100MΩ; Actuator/Cap Color: 白色; With Lamp: 不带; Pin Style: PC引脚; Operating Force: 2.5N; Mechanical Life: 10万次; Symbol: XKB5858-Z-E; Device: XKB5858-Z-E; LCSC Part Name: XKB5858-Z-E; Supplier Part: C780038; Manufacturer Part: XKB5858-Z-E; Supplier Footprint: 插件; JLCPCB Part Class: Extended Part; Datasheet: https://atta.szlcsc.com/upload/public/pdf/source/20211011/56D3FA9FC185EAC41365C3B37B684CC1.pdf; Supplier: LCSC; Convert to PCB: yes; Mounting Style: 卧插; Operating Temperature: -15℃~+55℃
U1 = PHB2.0-02-28PZZ: Manufacturer: XUNPU(讯普); Add into BOM: yes; Pins Structure: 2x14P; Pitch: 2mm; Number of PINs Per Row: 14; Current Rating (Max): 3A; Symbol: PHB2.0-02-28PZZ; Device: PHB2.0-02-28PZZ; LCSC Part Name: PHB2.0-02-28PZZ; Supplier Part: C19077315; Manufacturer Part: PHB2.0-02-28PZZ; Supplier Footprint: 插件,P=2mm; JLCPCB Part Class: Extended Part; Datasheet: https://atta.szlcsc.com/upload/public/pdf/source/20231025/E6D319634D2FEC92D75A874DF46F6A7E.pdf; Supplier: LCSC; Convert to PCB: yes; Mounting Style: 直插; Number of Pins: 28P; Number of Rows: 2; Row Spacing: 2mm; Operating Temperature Range: -25℃~+85℃